# EAGLE schematic NeuroStimDuino_v1_1 (EAGLE 9.6.2)

## Sheet 1 of 6
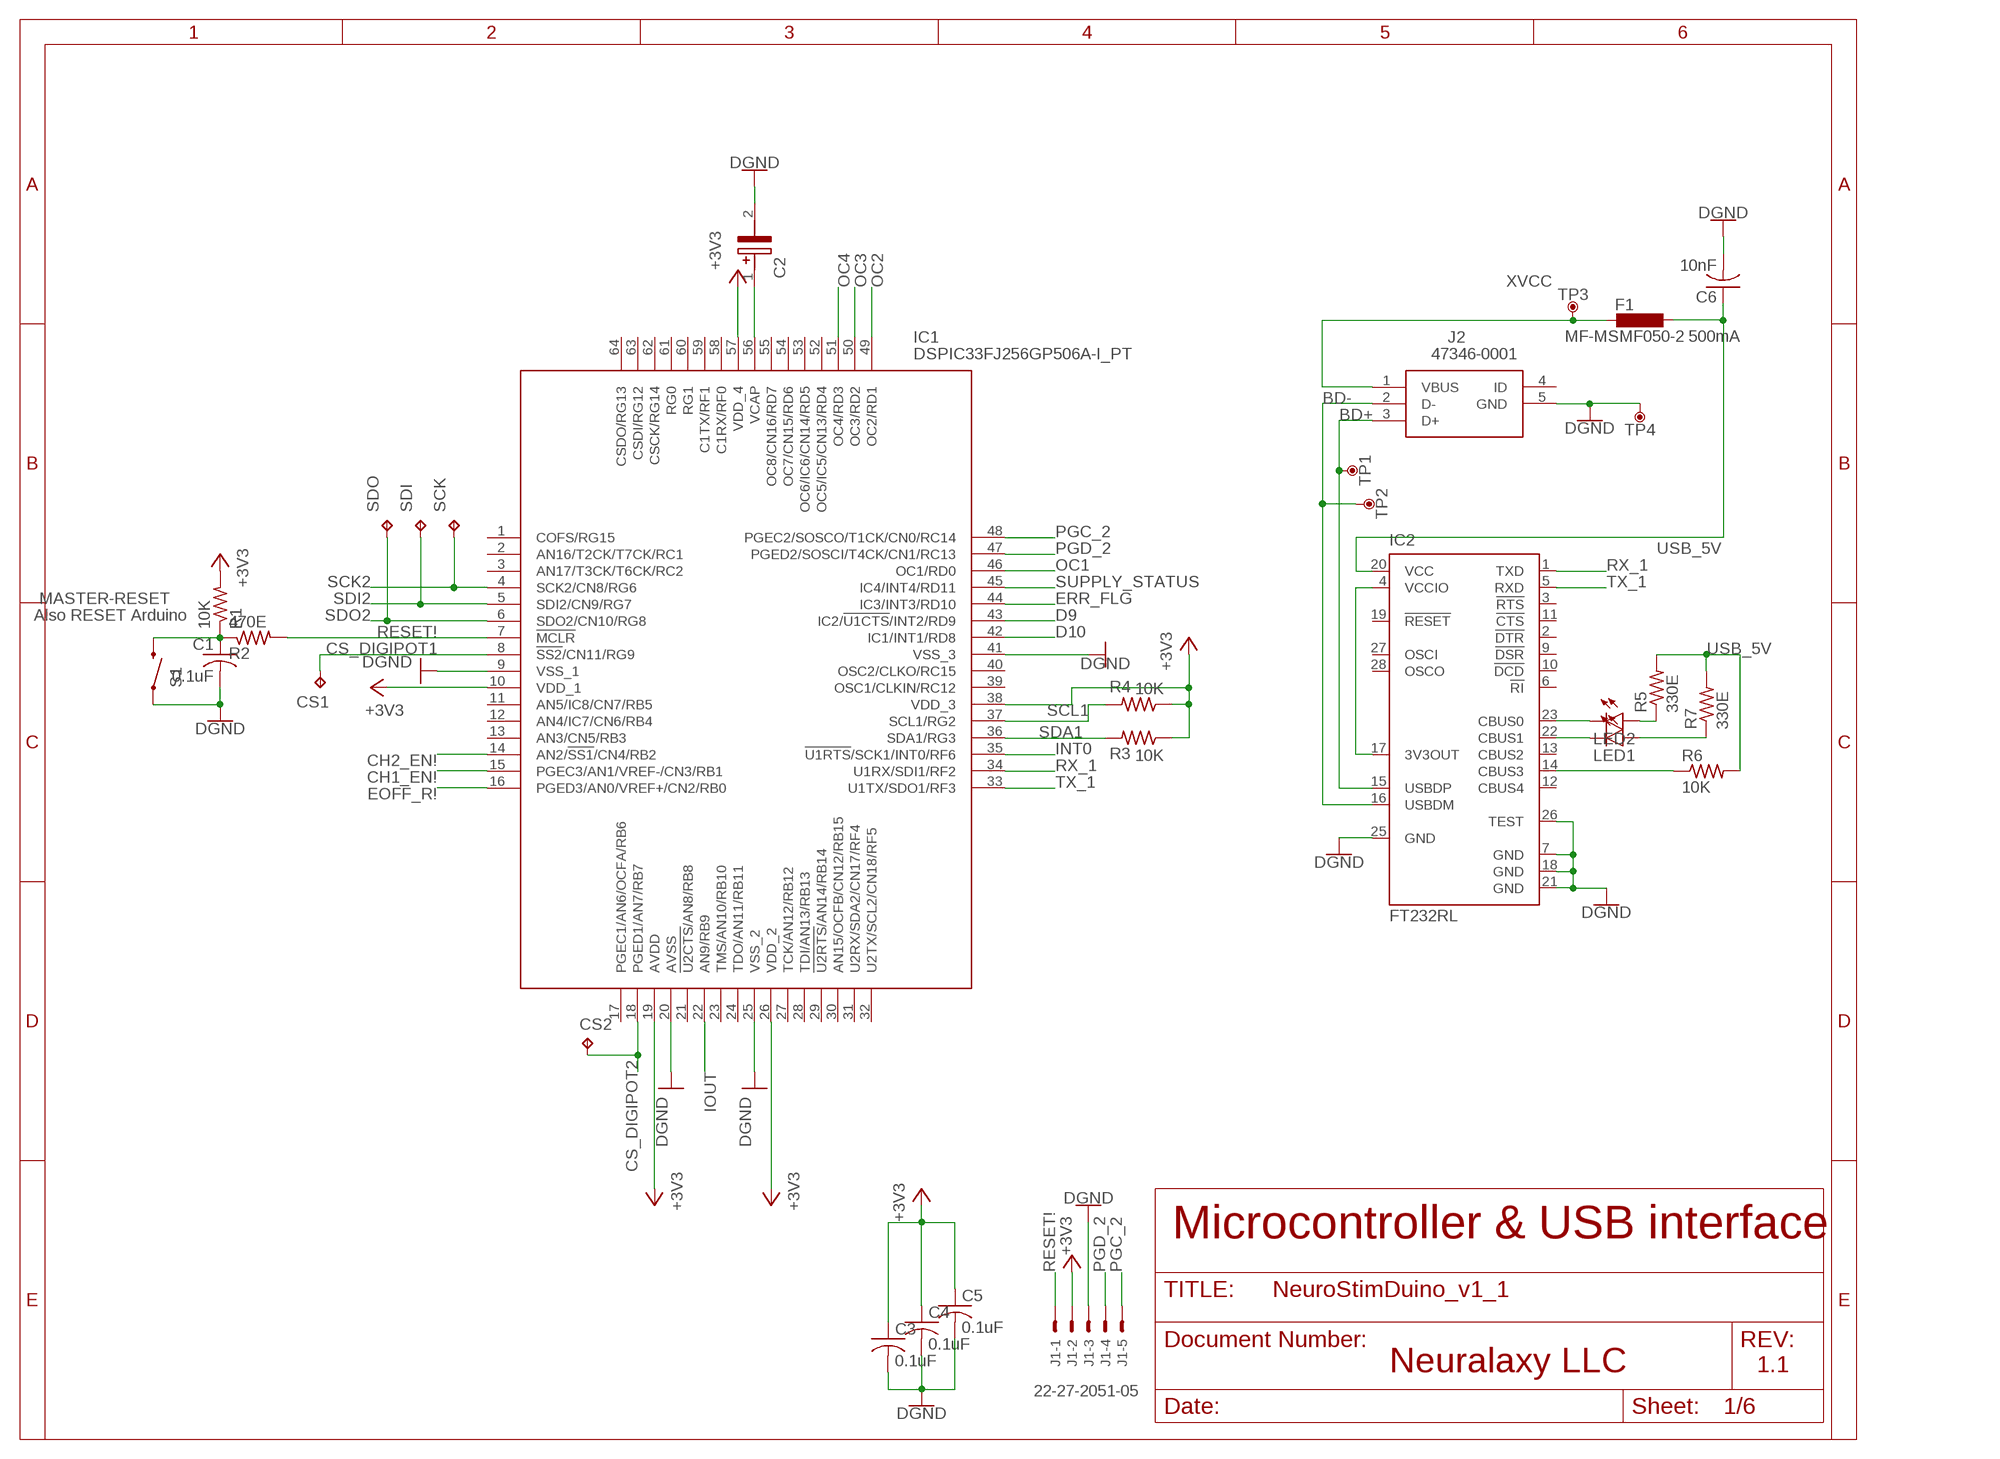
[diagram p0: schematic, sheet 1]

### Parts
C1  0.1uF  C-USC1206  [C1206]
C2  F971C475MAAHT3  [CAPPM3216X180N]
C3  0.1uF  C-USC1206  [C1206]
C4  0.1uF  C-USC1206  [C1206]
C5  0.1uF  C-USC1206  [C1206]
C6  10nF  C-USC1206  [C1206]
CS1  TPTP08R  [TP08R]
CS2  TPTP08R  [TP08R]
F1  MF-MSMF050-2 500mA  0002_MF-MSMF050-2  [L1812]
IC1  DSPIC33FJ256GP506A-I_PT  [QFP50P1200X1200X120-64N]
IC2  FT232RL  [SSOP28]
J1  22-27-2051-05  [6410-05]
J2  47346-0001  [47346-0001]
LED1  LEDCHIPLED_1206  [CHIPLED_1206]
LED2  LEDCHIPLED_1206  [CHIPLED_1206]
R1  10K  R-US_R1206  [R1206]
R2  470E  R-US_R1206  [R1206]
R3  10K  R-US_R1206  [R1206]
R4  10K  R-US_R1206  [R1206]
R5  330E  R-US_R1206  [R1206]
R6  10K  R-US_R1206  [R1206]
R7  330E  R-US_R1206  [R1206]
S1  SWITCH-MOMENTARY-2SMD  [TACTILE_SWITCH_SMD]
SCK  TPTP10R  [TP10R]
SDI  TPTP10R  [TP10R]
SDO  TPTP10R  [TP10R]
TP1  DNP  TPTP-1.00MM  [TP-1.00MM]
TP2  DNP  TPTP-1.00MM  [TP-1.00MM]
TP3  DNP  TPTP-1.00MM  [TP-1.00MM]
TP4  DNP  TPTP-1.00MM  [TP-1.00MM]

### Nets
+3V3: C3.1 C4.1 C5.1 IC1.10(VDD_1) IC1.19(AVDD) IC1.26(VDD_2) IC1.38(VDD_3) IC1.57(VDD_4) J1.2 R1.2 R3.1 R4.1 ; also sheet 2,3,4,5
BD+ [USBpair]: IC2.15(USBDP) J2.3(D+) TP1.X
BD- [USBpair]: IC2.16(USBDM) J2.2(D-) TP2.X
CH1_EN!: IC1.15(PGEC3/AN1/VREF-/CN3/RB1) ; also sheet 3
CH2_EN!: IC1.14(AN2/!SS1!/CN4/RB2) ; also sheet 3
CS_DIGIPOT1: CS1.TP IC1.8(!SS2!/CN11/RG9) ; also sheet 2
CS_DIGIPOT2: CS2.TP IC1.18(PGED1/AN7/RB7) ; also sheet 2
D9: IC1.43(IC2/!U1CTS!/INT2/RD9) ; also sheet 5
D10: IC1.42(IC1/INT1/RD8) ; also sheet 5
EOFF_R!: IC1.16(PGED3/AN0/VREF+/CN2/RB0) ; also sheet 5
ERR_FLG: IC1.44(IC3/INT3/RD10) ; also sheet 4
GND [Power]: C1.2 C2.2(-) C3.2 C4.2 C5.2 C6.2 IC1.9(VSS_1) IC1.20(AVSS) IC1.25(VSS_2) IC1.41(VSS_3) IC2.7(GND) IC2.18(GND) IC2.21(GND) IC2.25(GND) IC2.26(TEST) J1.3 J2.5(GND) S1.1 TP4.X ; supply symbol labelled DGND ; also sheet 2,3,4,5
INT0: IC1.35(!U1RTS!/SCK1/INT0/RF6) ; also sheet 5
IOUT: IC1.22(AN9/RB9) ; also sheet 3,5
MASTER-RESET: C1.1 R1.1 R2.1 S1.3 ; also sheet 5
N$1: C2.1(+) IC1.56(VCAP)
N$146: IC2.4(VCCIO) IC2.17(3V3OUT)
N$147: IC2.23(CBUS0) LED2.C
N$148: LED2.A R5.1
N$149: LED1.A R7.1
N$150: IC2.22(CBUS1) LED1.C
N$151: IC2.14(CBUS3) R6.1
OC1: IC1.46(OC1/RD0) ; also sheet 2
OC2: IC1.49(OC2/RD1) ; also sheet 2
OC3: IC1.50(OC3/RD2) ; also sheet 2
OC4: IC1.51(OC4/RD3) ; also sheet 2
PGC_2: IC1.48(PGEC2/SOSCO/T1CK/CN0/RC14) J1.5
PGD_2: IC1.47(PGED2/SOSCI/T4CK/CN1/RC13) J1.4
RESET!: IC1.7(!MCLR) J1.1 R2.2
RX_1: IC1.34(U1RX/SDI1/RF2) IC2.1(TXD)
SCK2: IC1.4(SCK2/CN8/RG6) SCK.TP ; also sheet 2
SCL1: IC1.37(SCL1/RG2) R4.2 ; also sheet 5
SDA1: IC1.36(SDA1/RG3) R3.2 ; also sheet 5
SDI2: IC1.5(SDI2/CN9/RG7) SDI.TP ; also sheet 2
SDO2: IC1.6(SDO2/CN10/RG8) SDO.TP ; also sheet 2
SUPPLY_STATUS: IC1.45(IC4/INT4/RD11) ; also sheet 4
TX_1: IC1.33(U1TX/SDO1/RF3) IC2.5(RXD)
USB_5V: C6.1 F1.1 IC2.20(VCC) R5.2 R6.2 R7.2 ; also sheet 4
XVCC [usbvcc]: F1.2 J2.1(VBUS) TP3.X
Unconnected: IC1.1(COFS/RG15) IC1.2(AN16/T2CK/T7CK/RC1) IC1.3(AN17/T3CK/T6CK/RC2) IC1.11(AN5/IC8/CN7/RB5) IC1.12(AN4/IC7/CN6/RB4) IC1.13(AN3/CN5/RB3) IC1.17(PGEC1/AN6/OCFA/RB6) IC1.21(!U2CTS!/AN8/RB8) IC1.23(TMS/AN10/RB10) IC1.24(TDO/AN11/RB11) IC1.27(TCK/AN12/RB12) IC1.28(TDI/AN13/RB13) IC1.29(!U2RTS!/AN14/RB14) IC1.30(AN15/OCFB/CN12/RB15) IC1.31(U2RX/SDA2/CN17/RF4) IC1.32(U2TX/SCL2/CN18/RF5) IC1.39(OSC1/CLKIN/RC12) IC1.40(OSC2/CLKO/RC15) IC1.52(OC5/IC5/CN13/RD4) IC1.53(OC6/IC6/CN14/RD5) IC1.54(OC7/CN15/RD6) IC1.55(OC8/CN16/RD7) IC1.58(C1RX/RF0) IC1.59(C1TX/RF1) IC1.60(RG1) IC1.61(RG0) IC1.62(CSCK/RG14) IC1.63(CSDI/RG12) IC1.64(CSDO/RG13) IC2.2(!DTR) IC2.3(!RTS) IC2.6(!RI) IC2.9(!DSR) IC2.10(!DCD) IC2.11(!CTS) IC2.12(CBUS4) IC2.13(CBUS2) IC2.19(!RESET) IC2.27(OSCI) IC2.28(OSCO) J2.4(ID)

### Notes on the sheet
- Also RESET Arduino
- Microcontroller & USB interface
- Neuralaxy LLC | 1.1

## Sheet 2 of 6
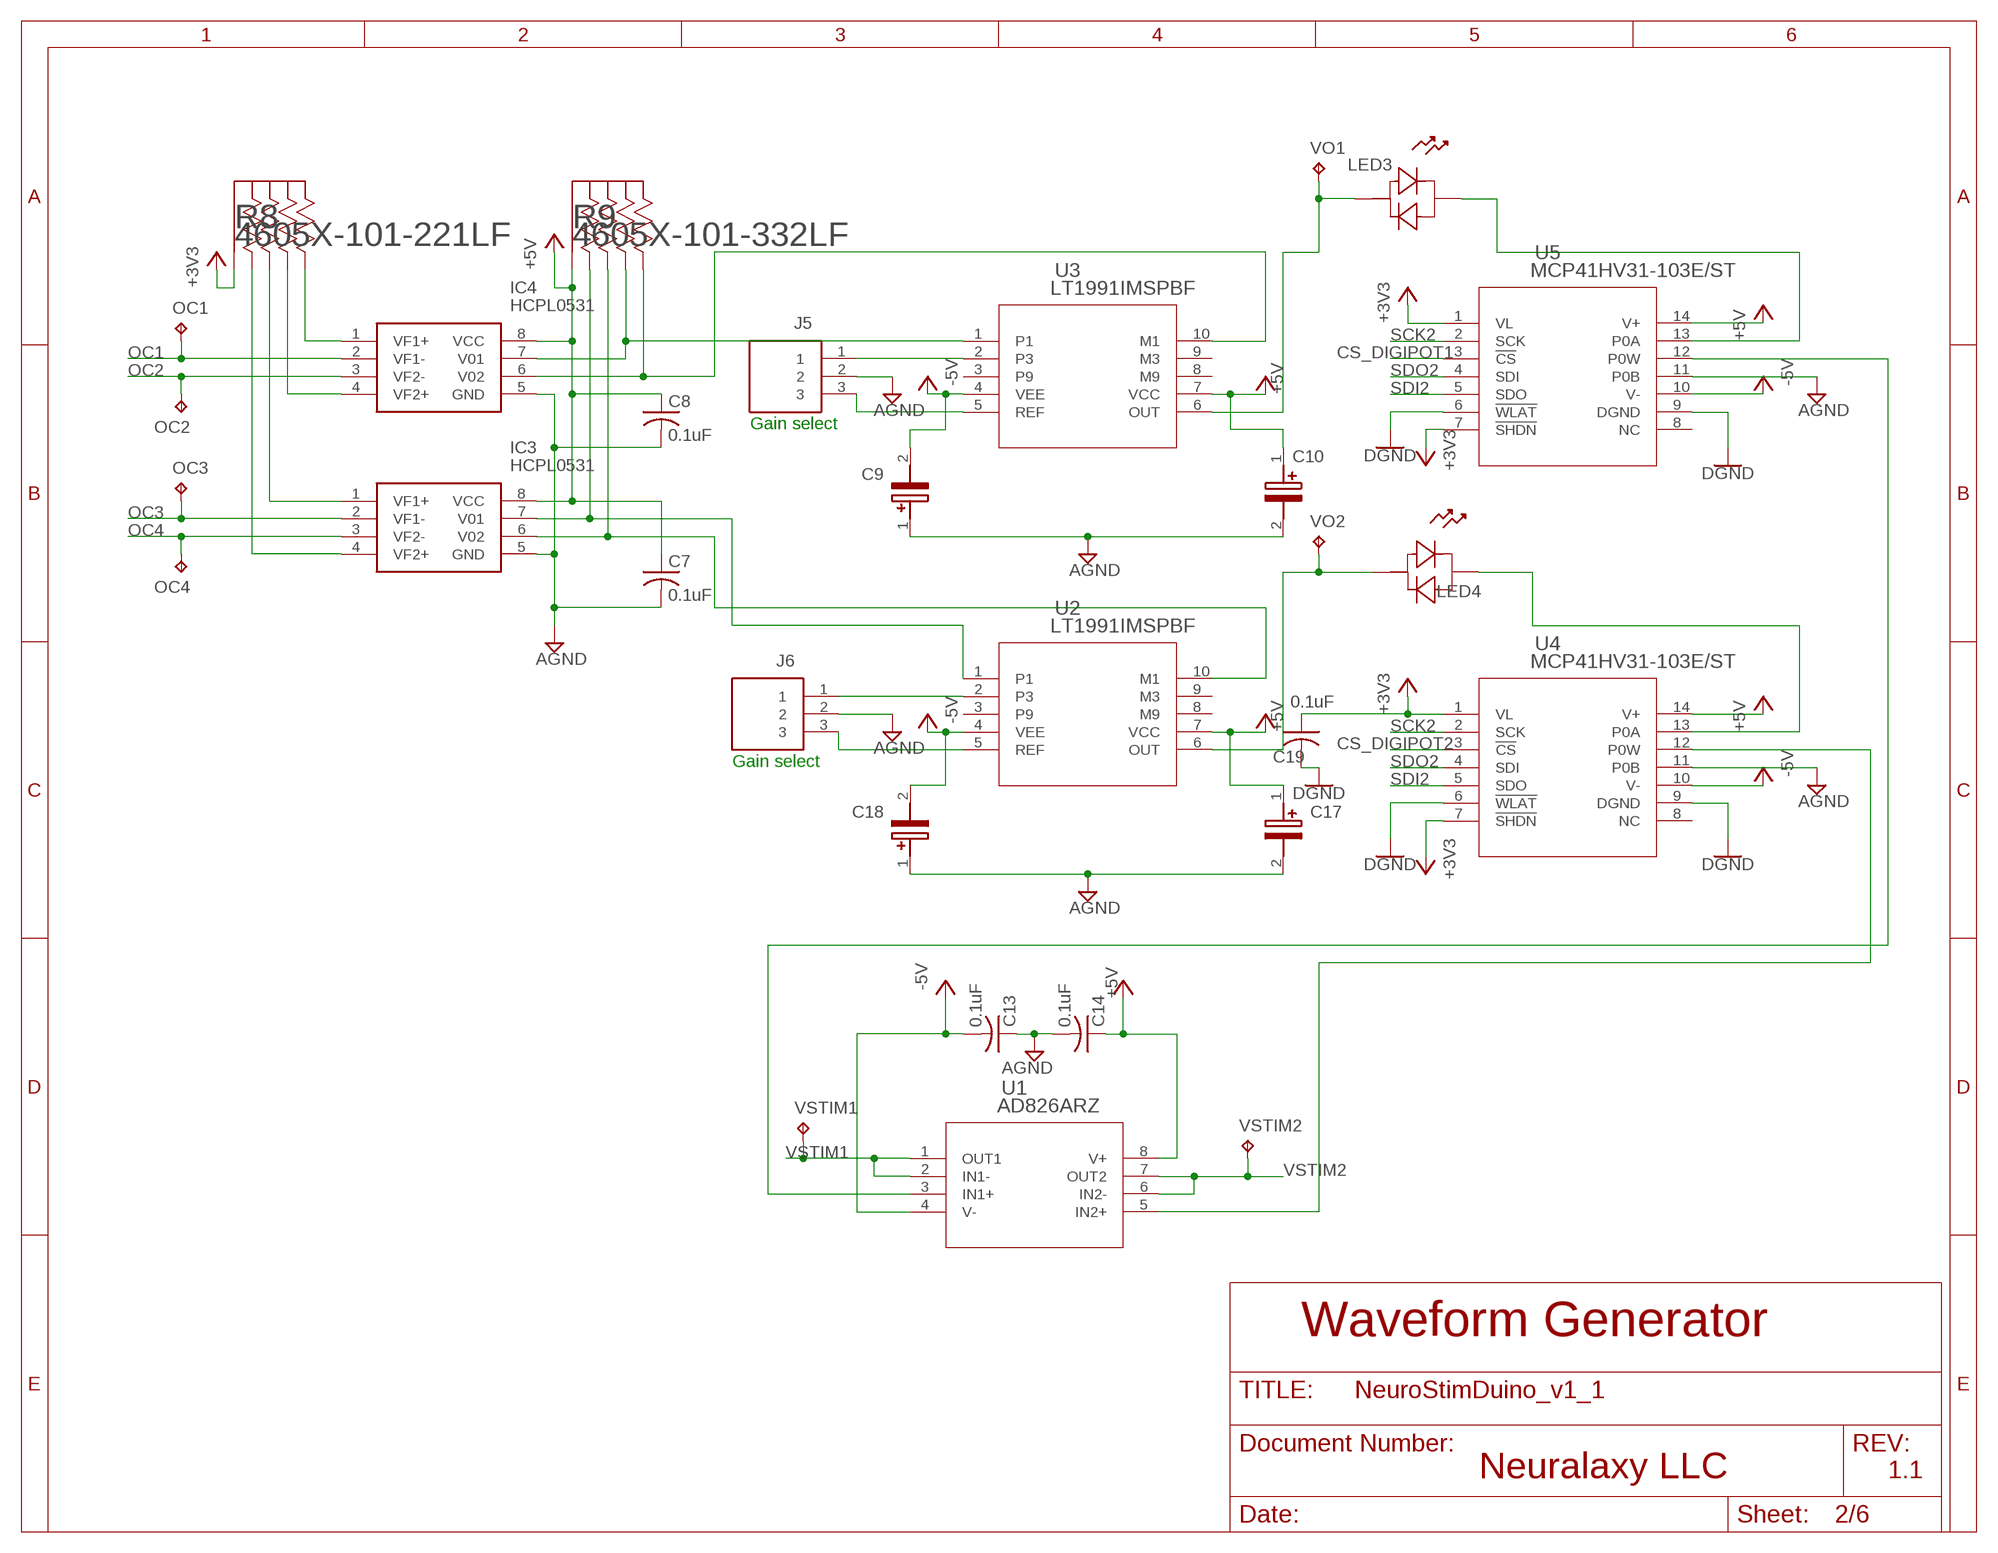
[diagram p1: schematic, sheet 2]

### Parts
C7  0.1uF  C-USC1206  [C1206]
C8  0.1uF  C-USC1206  [C1206]
C9  F971C475MAAHT3  [CAPPM3216X180N]
C10  F971C475MAAHT3  [CAPPM3216X180N]
C13  0.1uF  C-USC1206  [C1206]
C14  0.1uF  C-USC1206  [C1206]
C17  F971C475MAAHT3  [CAPPM3216X180N]
C18  F971C475MAAHT3  [CAPPM3216X180N]
C19  0.1uF  C-USC1206  [C1206]
IC3  HCPL0531  [SOIC127P594X363-8N]
IC4  HCPL0531  [SOIC127P594X363-8N]
J5  TMS-103-02-L-S  [TMS-103-YY-XX-S]
J6  TMS-103-02-L-S  [TMS-103-YY-XX-S]
LED3  XZMDKVG55W-4  [LED_KVG55W-4_SLD]
LED4  XZMDKVG55W-4  [LED_KVG55W-4_SLD]
OC1  TPTP08R  [TP08R]
OC2  TPTP08R  [TP08R]
OC3  TPTP10R  [TP10R]
OC4  TPTP10R  [TP10R]
R8  4605X-101-221LF  [BO_4605X]
R9  4605X-101-332LF  [BO_4605X]
U1  AD826ARZ  [R_8_ADI]
U2  LT1991IMSPBF  [MSOP-10_MS_LIT]
U3  LT1991IMSPBF  [MSOP-10_MS_LIT]
U4  MCP41HV31-103E/ST  [TSSOP14_MC_MCH]
U5  MCP41HV31-103E/ST  [TSSOP14_MC_MCH]
VO1  TPTP10R  [TP10R]
VO2  TPTP10R  [TP10R]
VSTIM1  TPTP08R  [TP08R]
VSTIM2  TPTP08R  [TP08R]

### Nets
+3V3: C19.1 R8.1 U4.1(VL) U4.7(!SHDN) U5.1(VL) U5.7(!SHDN) ; also sheet 1,3,4,5
+5V: C7.1 C8.1 C10.1(+) C14.1 C17.1(+) IC3.8(VCC) IC4.8(VCC) R9.1 U1.8(V+) U2.7(VCC) U3.7(VCC) U4.14(V+) U5.14(V+) ; also sheet 3,4
-5V: C9.2(-) C13.2 C18.2(-) U1.4(V-) U2.4(VEE) U3.4(VEE) U4.10(V-) U5.10(V-) ; also sheet 4
AGND: C7.2 C8.2 C9.1(+) C10.2(-) C13.1 C14.2 C17.2(-) C18.1(+) IC3.5(GND) IC4.5(GND) J5.2 J6.2 U4.11(P0B) U5.11(P0B) ; also sheet 3,4
CS_DIGIPOT1: U5.3(!CS) ; also sheet 1
CS_DIGIPOT2: U4.3(!CS) ; also sheet 1
GND [Power]: C19.2 U4.6(!WLAT) U4.9(DGND) U5.6(!WLAT) U5.9(DGND) ; supply symbol labelled DGND ; also sheet 1,3,4,5
N$2: J5.3 U3.5(REF)
N$3: IC4.7(V01) R9.4 U3.1
N$4: IC4.6(V02) R9.5 U3.10(M1)
N$5: IC3.7(V01) R9.2 U2.1
N$7: IC3.6(V02) R9.3 U2.10(M1)
N$8: IC4.4(VF2+) R8.4
N$9: IC4.1(VF1+) R8.5
N$13: IC3.1(VF1+) R8.3
N$15: IC3.4(VF2+) R8.2
N$16: LED3.1 U3.6(OUT) VO1.TP
N$21: J5.1 U3.2(P3)
N$22: J6.3 U2.5(REF)
N$23: J6.1 U2.2(P3)
N$24: U1.3(IN1+) U5.12(P0W)
N$26: U1.5(IN2+) U4.12(P0W)
N$27: LED4.1 U2.6(OUT) VO2.TP
N$32: LED3.2 U5.13(P0A)
N$38: LED4.2 U4.13(P0A)
OC1: IC4.2(VF1-) OC1.TP ; also sheet 1
OC2: IC4.3(VF2-) OC2.TP ; also sheet 1
OC3: IC3.2(VF1-) OC3.TP ; also sheet 1
OC4: IC3.3(VF2-) OC4.TP ; also sheet 1
SCK2: U4.2(SCK) U5.2(SCK) ; also sheet 1
SDI2: U4.5(SDO) U5.5(SDO) ; also sheet 1
SDO2: U4.4(SDI) U5.4(SDI) ; also sheet 1
VSTIM1: U1.1(OUT1) U1.2(IN1-) VSTIM1.TP ; also sheet 3
VSTIM2: U1.6(IN2-) U1.7(OUT2) VSTIM2.TP ; also sheet 3
Unconnected: U2.3(P9) U2.8(M9) U2.9(M3) U3.3(P9) U3.8(M9) U3.9(M3) U4.8(NC) U5.8(NC)

### Notes on the sheet
- Gain select
- Gain select
- Waveform Generator
- Neuralaxy LLC | 1.1

## Sheet 3 of 6
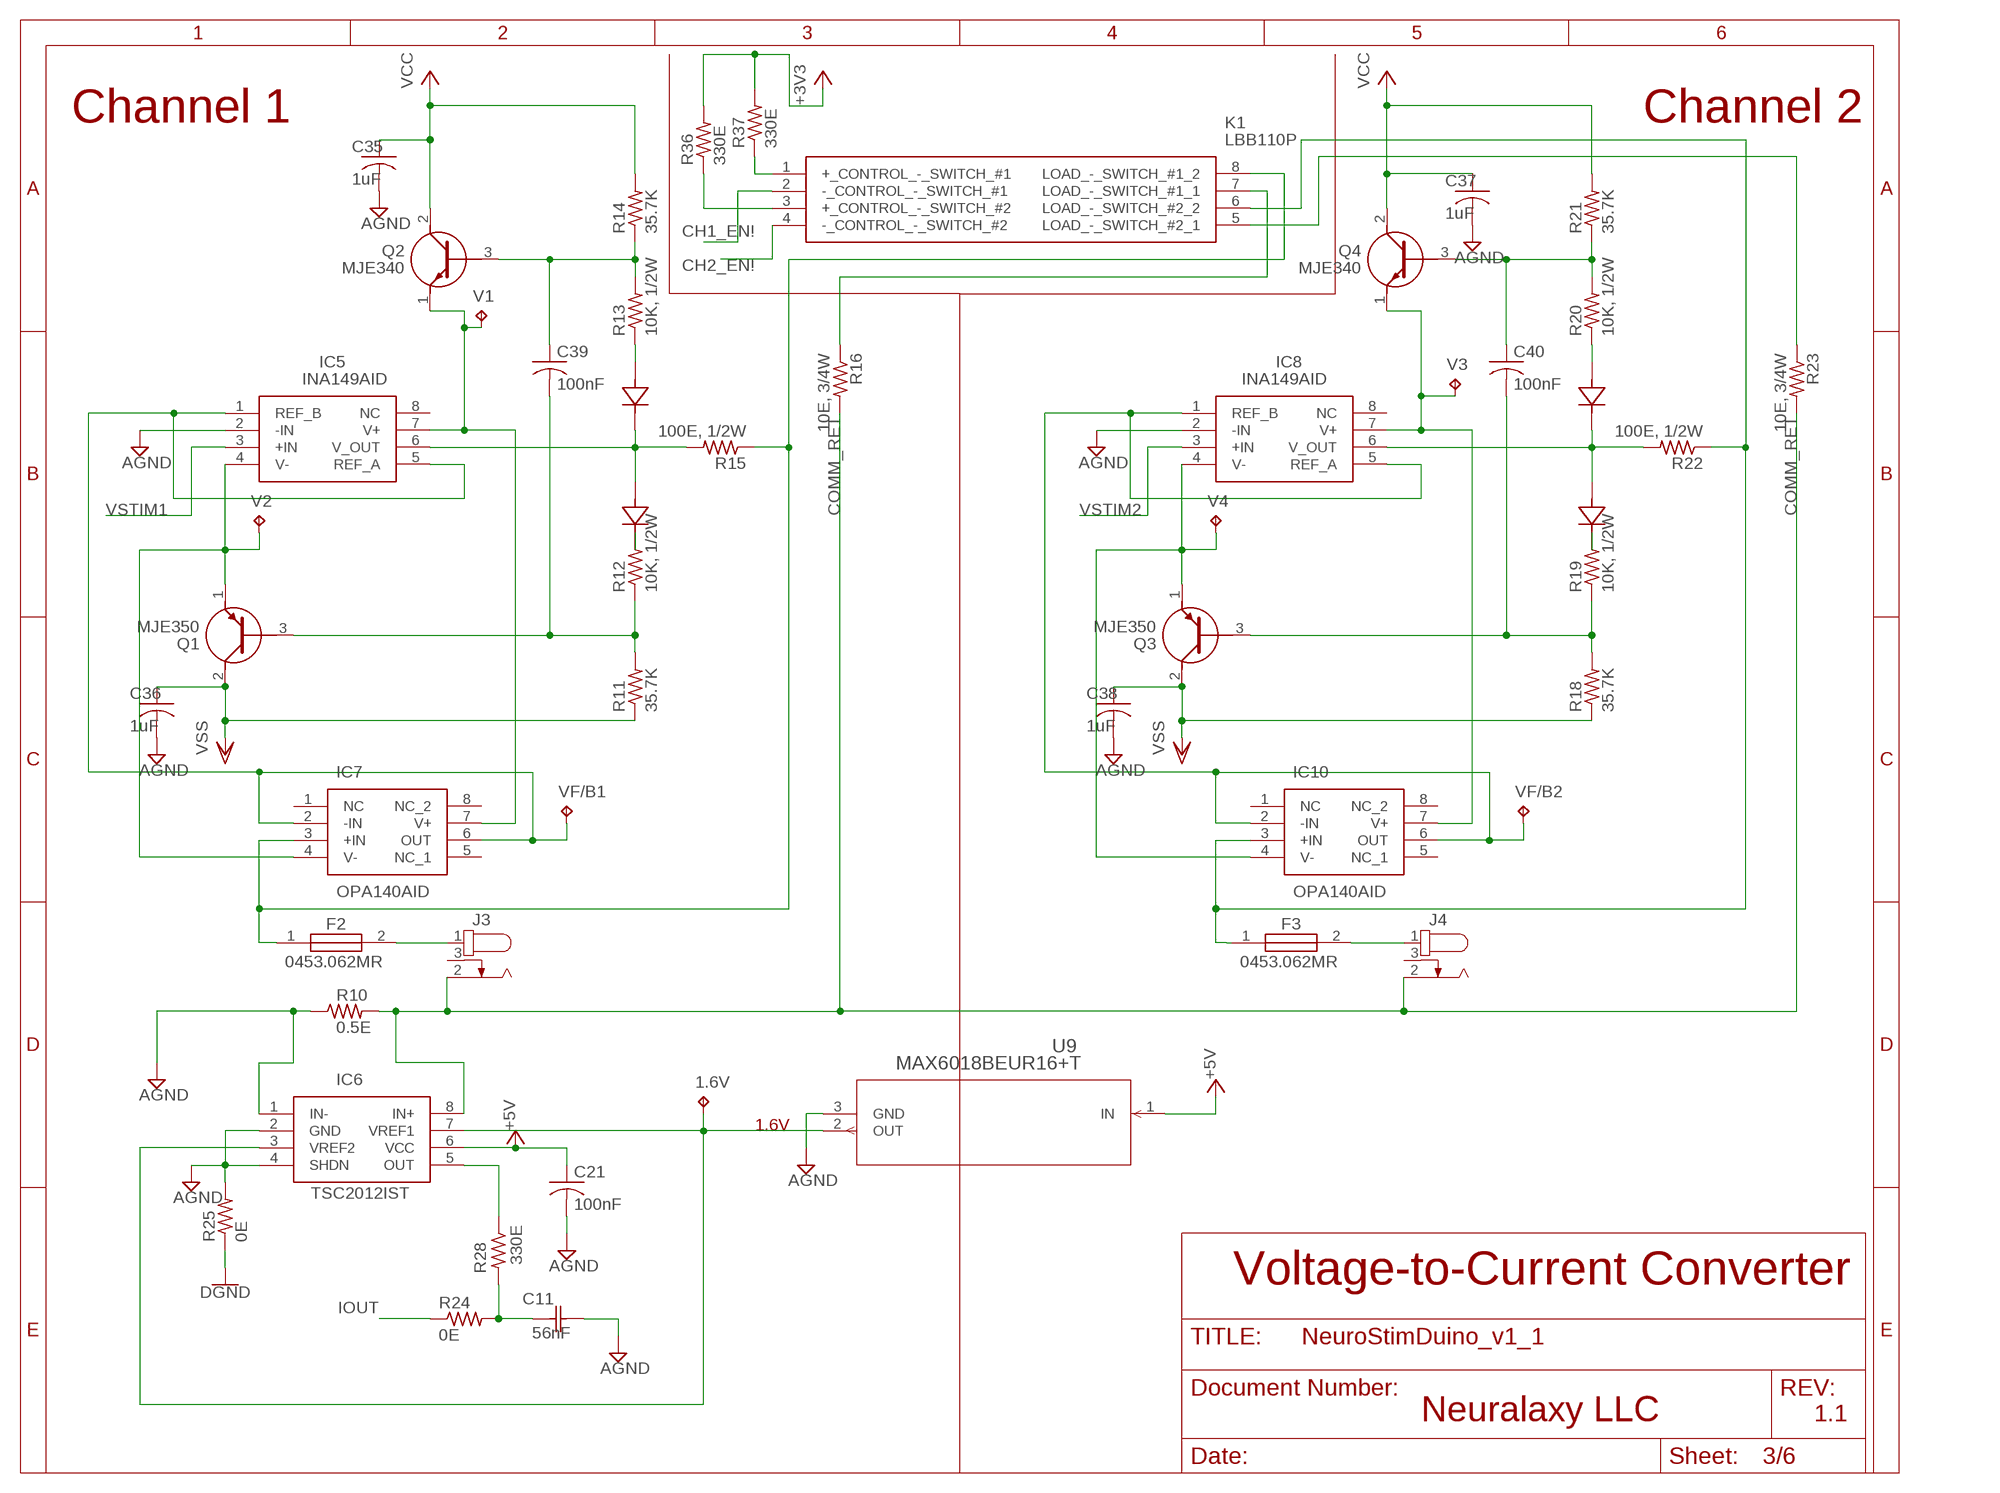
[diagram p2: schematic, sheet 3]

### Parts
1.6V  TPTP10R  [TP10R]
C11  56nF  C0603C563J4RACTU  [CAPC17595_87N_KEM]
C21  100nF  C-USC1206  [C1206]
C35  1uF  C-USC0805  [C0805]
C36  1uF  C-USC0805  [C0805]
C37  1uF  C-USC0805  [C0805]
C38  1uF  C-USC0805  [C0805]
C39  100nF  C-USC0805K  [C0805K]
C40  100nF  C-USC0805K  [C0805K]
D6  GF1J-E3DO-214BA-L  [DO-214BA-L]
D7  GF1J-E3DO-214BA-L  [DO-214BA-L]
D8  GF1J-E3DO-214BA-L  [DO-214BA-L]
D9  GF1J-E3DO-214BA-L  [DO-214BA-L]
F2  0453.062MR  [FUSC6127X294N]
F3  0453.062MR  [FUSC6127X294N]
IC5  INA149AID  [SOIC127P600X175-8N]
IC6  TSC2012IST  [SOP65P490X110-8N]
IC7  OPA140AID  [SOIC127P600X175-8N]
IC8  INA149AID  [SOIC127P600X175-8N]
IC10  OPA140AID  [SOIC127P600X175-8N]
J3  694101308002  [694101308002]
J4  694101308002  [694101308002]
K1  LBB110P  [SOP254P940X229-8N]
Q1  MJE350  [TO229P300X760X1364-3P]
Q2  MJE340  [TO229P290X760X1320-3P]
Q3  MJE350  [TO229P300X760X1364-3P]
Q4  MJE340  [TO229P290X760X1320-3P]
R10  0.5E  R-US_R1206  [R1206]
R11  35.7K  R-US_R1206  [R1206]
R12  10K, 1/2W  R-US_R1206  [R1206]
R13  10K, 1/2W  R-US_R1206  [R1206]
R14  35.7K  R-US_R1206  [R1206]
R15  100E, 1/2W  R-US_R1206  [R1206]
R16  10E, 3/4W  R-US_R1206  [R1206]
R18  35.7K  R-US_R1206  [R1206]
R19  10K, 1/2W  R-US_R1206  [R1206]
R20  10K, 1/2W  R-US_R1206  [R1206]
R21  35.7K  R-US_R1206  [R1206]
R22  100E, 1/2W  R-US_R1206  [R1206]
R23  10E, 3/4W  R-US_R1206  [R1206]
R24  0E  R-US_R1206  [R1206]
R25  0E  R-US_R1206  [R1206]
R28  330E  R-US_R0603  [R0603]
R36  330E  R-US_R1206  [R1206]
R37  330E  R-US_R1206  [R1206]
U9  MAX6018BEUR16+T  [21-0051H_MXM]
V1  TPTP10R  [TP10R]
V2  TPTP10R  [TP10R]
V3  TPTP10R  [TP10R]
V4  TPTP10R  [TP10R]
VF/B1  TPTP10R  [TP10R]
VF/B2  TPTP10R  [TP10R]

### Nets
+3V3: R36.2 R37.2 ; also sheet 1,2,4,5
+5V: C21.1 IC6.6(VCC) U9.1(IN) ; also sheet 2,4
AGND: C11.2 C21.2 C35.2 C36.2 C37.2 C38.2 IC5.2(-IN) IC6.1(IN-) IC6.2(GND) IC6.4(SHDN) IC8.2(-IN) R10.1 R25.2 U9.3(GND) ; also sheet 2,4
CH1_EN!: K1.2(-_CONTROL_-_SWITCH_#1) ; also sheet 1
CH2_EN!: K1.4(-_CONTROL_-_SWITCH_#2) ; also sheet 1
COMM_RET: IC6.8(IN+) J3.2 J4.2 R10.2 R16.2 R23.2
GND [Power]: R25.1 ; supply symbol labelled DGND ; also sheet 1,2,4,5
IOUT: R24.1 ; also sheet 1,5
N$14: K1.1(+_CONTROL_-_SWITCH_#1) R37.1
N$17: K1.3(+_CONTROL_-_SWITCH_#2) R36.1
N$19: IC6.5(OUT) R28.1
N$25: 1.6V.TP IC6.3(VREF2) IC6.7(VREF1) U9.2(OUT)
N$28: C11.1 R24.2 R28.2
N$45: IC5.4(V-) IC7.4(V-) Q1.1(E) V2.TP
N$46: IC5.1(REF_B) IC5.5(REF_A) IC7.2(-IN) IC7.6(OUT) VF/B1.TP
N$47: C39.1 Q2.3(B) R13.2 R14.1
N$48: C39.2 Q1.3(B) R11.2 R12.1
N$49: D6.2 R13.1
N$50: D7.1 R12.2
N$51: D6.1 D7.2 IC5.6(V_OUT) R15.2
N$52: IC5.7(V+) IC7.7(V+) Q2.1(E) V1.TP
N$53: K1.7(LOAD_-_SWITCH_#1_1) R16.1
N$54: F2.1 IC7.3(+IN) K1.8(LOAD_-_SWITCH_#1_2) R15.1
N$55: K1.5(LOAD_-_SWITCH_#2_1) R23.1
N$56: F2.2 J3.1
N$57: C40.1 Q4.3(B) R20.2 R21.1
N$58: C40.2 Q3.3(B) R18.2 R19.1
N$59: D8.2 R20.1
N$60: D9.1 R19.2
N$61: D8.1 D9.2 IC8.6(V_OUT) R22.2
N$62: IC8.1(REF_B) IC8.5(REF_A) IC10.2(-IN) IC10.6(OUT) VF/B2.TP
N$63: IC8.7(V+) IC10.7(V+) Q4.1(E) V3.TP
N$64: IC8.4(V-) IC10.4(V-) Q3.1(E) V4.TP
N$65: F3.1 IC10.3(+IN) K1.6(LOAD_-_SWITCH_#2_2) R22.1
N$66: F3.2 J4.1
VCC: C35.1 C37.1 Q2.2(C) Q4.2(C) R14.2 R21.2 ; also sheet 4
VSS: C36.1 C38.1 Q1.2(C) Q3.2(C) R11.1 R18.1 ; also sheet 4
VSTIM1: IC5.3(+IN) ; also sheet 2
VSTIM2: IC8.3(+IN) ; also sheet 2
Unconnected: IC5.8(NC) IC7.1(NC) IC7.5(NC_1) IC7.8(NC_2) IC8.8(NC) IC10.1(NC) IC10.5(NC_1) IC10.8(NC_2) J3.3 J4.3

### Notes on the sheet
- Channel 1 | Channel 2
- 1.6V
- TSC2012IST
- Voltage-to-Current Converter
- Neuralaxy LLC | 1.1

## Sheet 4 of 6
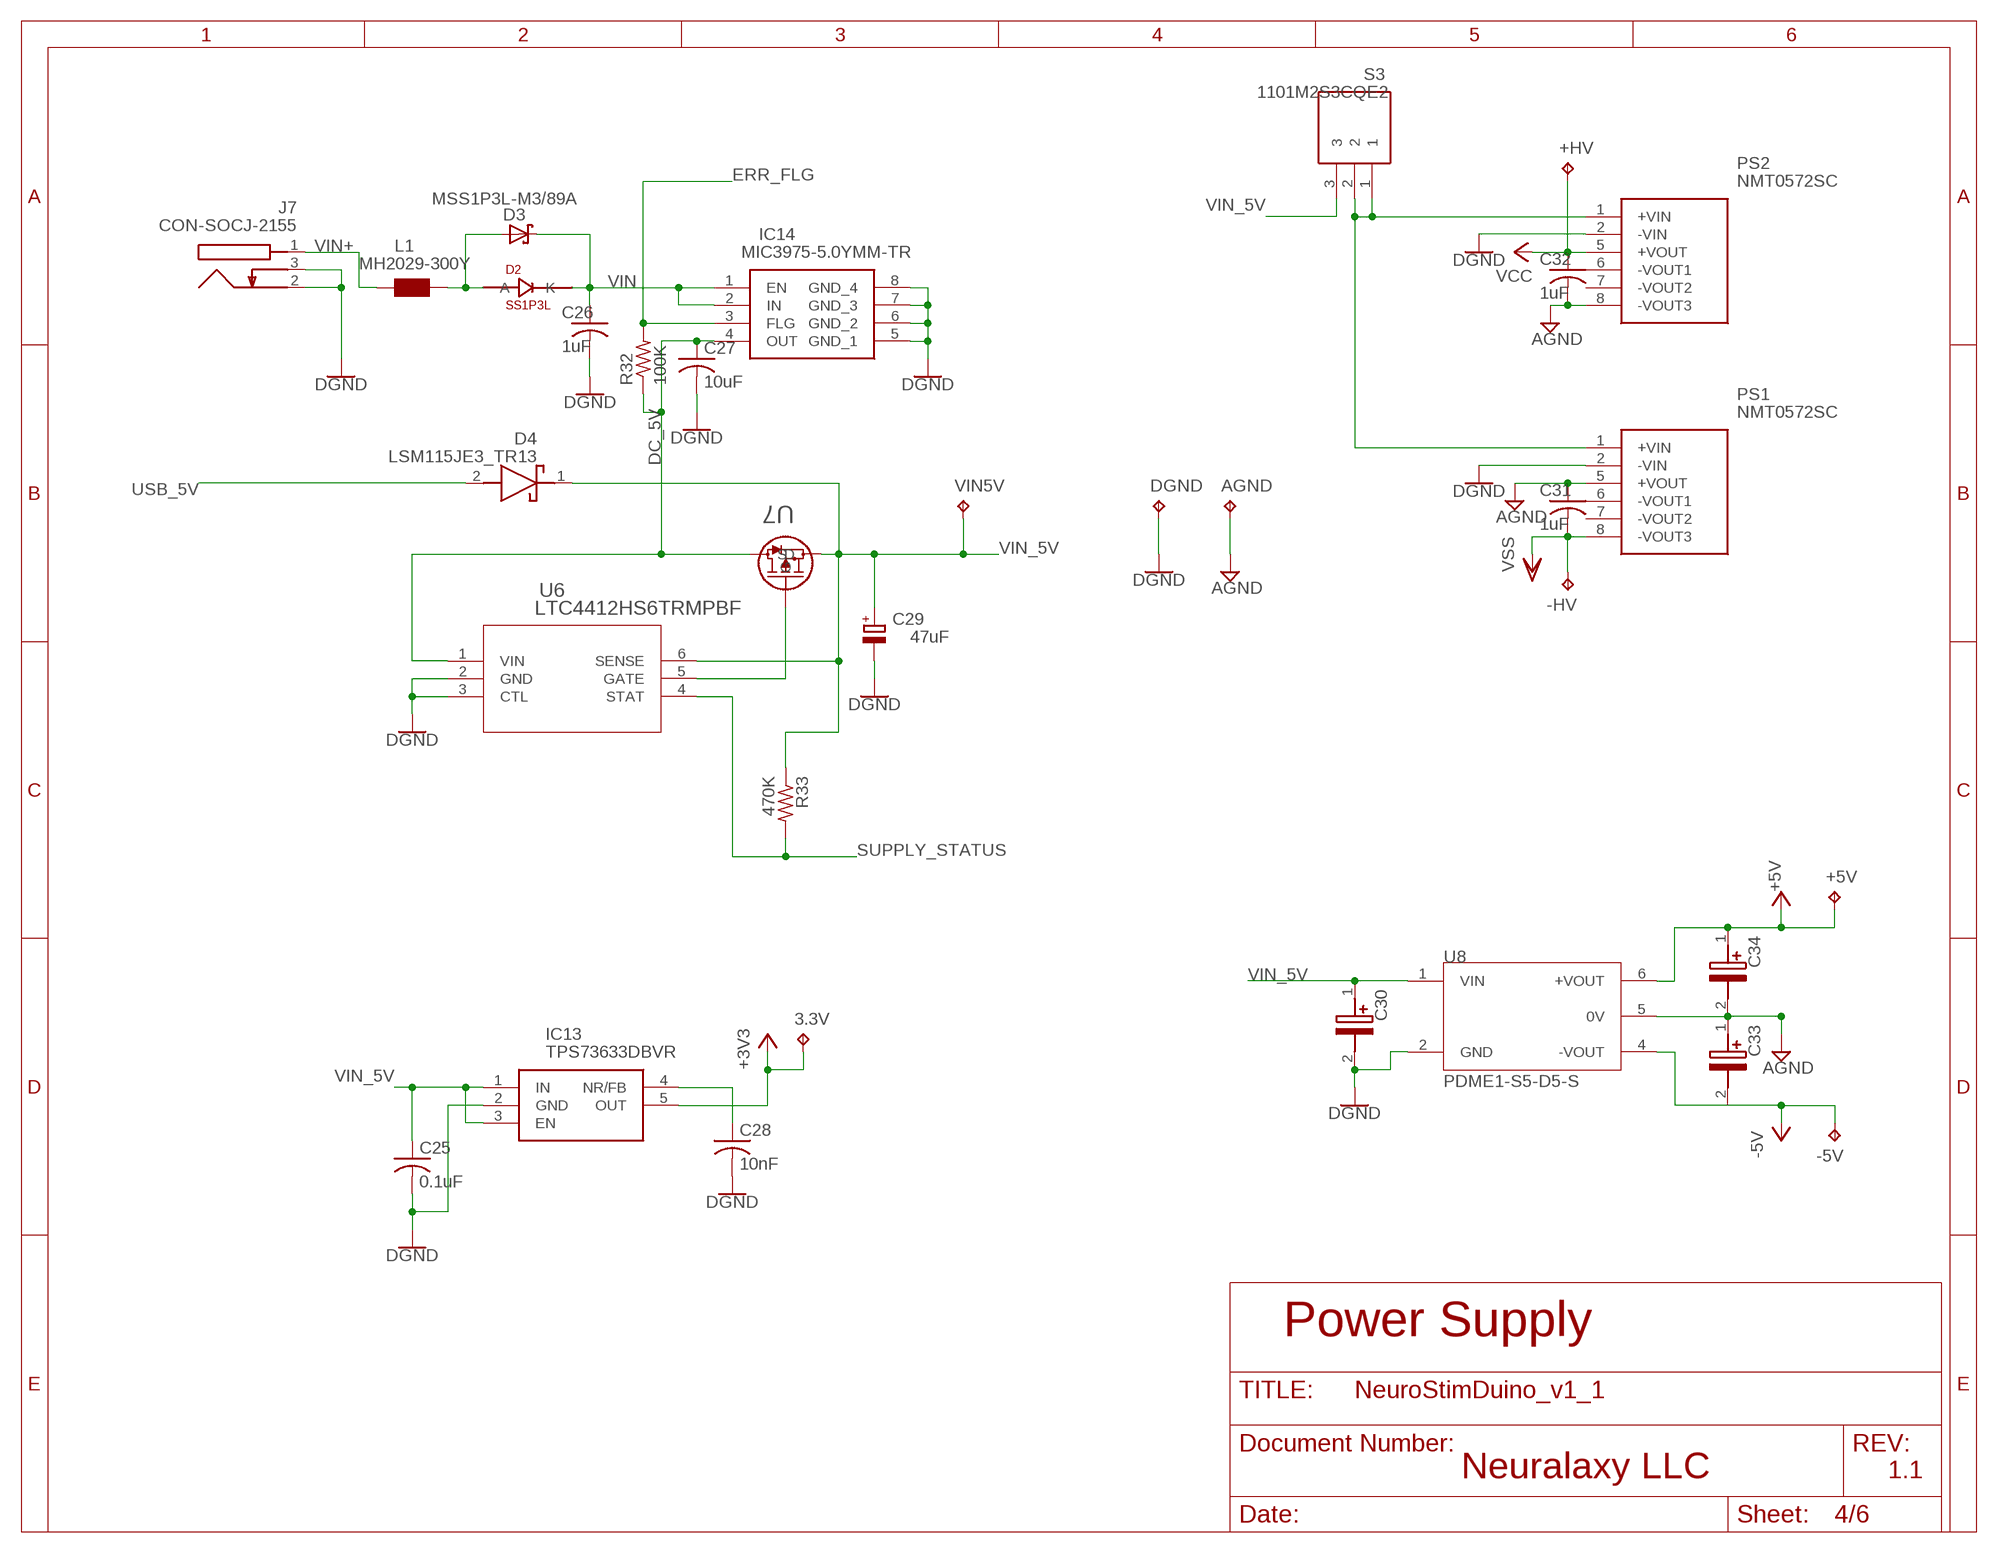
[diagram p3: schematic, sheet 4]

### Parts
3.3V  TPTP10R  [TP10R]
+5V  TPTP10R  [TP10R]
+HV  TPTP10R  [TP10R]
-5V  TPTP10R  [TP10R]
-HV  TPTP10R  [TP10R]
AGND  TPTP10R  [TP10R]
C25  0.1uF  C-USC1206  [C1206]
C26  1uF  C-USC0805  [C0805]
C27  10uF  C-USC0805  [C0805]
C28  10nF  C-USC1206  [C1206]
C29  47uF  0113_47UF  [PANASONIC_D]
C30  4.7uF  593D475X9050D2TE3  [CAPPM7343X310N]
C31  1uF  C-USC0805  [C0805]
C32  1uF  C-USC0805  [C0805]
C33  4.7uF  593D475X9050D2TE3  [CAPPM7343X310N]
C34  4.7uF  593D475X9050D2TE3  [CAPPM7343X310N]
D2  SS1P3L  0025_SS1P3L-M3/84A  [DO220AAL]
D3  MSS1P3L-M3/89A  1653_MSS1P3L-M3/89A  [MICROSMP]
D4  LSM115JE3_TR13  [DIOM5436X330N]
DGND  TPTP10R  [TP10R]
IC13  TPS73633DBVR  [SOT95P280X145-5N]
IC14  MIC3975-5.0YMM-TR  [SOP65P490X109-8N]
J7  CON-SOCJ-2155  [CONSOCJ2155]
L1  MH2029-300Y  0001_BLM21PG300SN1D_/_MH2029-300Y  [0805]
PS1  NMT0572SC  [NMT1272SC]
PS2  NMT0572SC  [NMT1272SC]
R32  100K  R-US_R1206  [R1206]
R33  470K  R-US_R1206  [R1206]
S3  1101M2S3CQE2  [1000-SERIES(SPDT)]
U6  LTC4412HS6TRMPBF  [TSOT-23_S6_ADI]
U7  PMV48XP,215TO-236_SOT23_NEX-L  [TO-236_SOT23_NEX-L]
U8  PDME1-S5-D5-S  [CONV_PDME1-S5-D5-S]
VIN5V  TPTP10R  [TP10R]

### Nets
+3V3: 3.3V.TP IC13.5(OUT) ; also sheet 1,2,3,5
+5V: +5V.TP C34.1(+) U8.6(+VOUT) ; also sheet 2,3
-5V: -5V.TP C33.2(-) U8.4(-VOUT) ; also sheet 2
AGND: AGND.TP C31.1 C32.2 C33.1(+) C34.2(-) PS1.5(+VOUT) PS2.8(-VOUT3) U8.5(0V) ; also sheet 2,3
DC_5V: C27.1 IC14.4(OUT) R32.1 U6.1(VIN) U7.3(D)
ERR_FLG: IC14.3(FLG) R32.2 ; also sheet 1
GND [Power]: C25.2 C26.2 C27.2 C28.2 C29.- C30.2(-) DGND.TP IC13.2(GND) IC14.5(GND_1) IC14.6(GND_2) IC14.7(GND_3) IC14.8(GND_4) J7.2 J7.3 PS1.2(-VIN) PS2.2(-VIN) U6.2(GND) U6.3(CTL) U8.2(GND) ; supply symbol labelled DGND ; also sheet 1,2,3,5
N$6: C28.1 IC13.4(NR/FB)
N$10: PS1.1(+VIN) PS2.1(+VIN) S3.1 S3.2
N$20: U6.5(GATE) U7.1(G)
N$107: D2.P$2(A) D3.A L1.1
SUPPLY_STATUS: R33.2 U6.4(STAT) ; also sheet 1
USB_5V: D4.2(A) ; also sheet 1
VCC: +HV.TP C32.1 PS2.5(+VOUT) ; also sheet 3
VIN: C26.1 D2.P$1(K) D3.K(C) IC14.1(EN) IC14.2(IN) ; also sheet 5
VIN+: J7.1 L1.2
VIN_5V: C25.1 C29.+ C30.1(+) D4.1(K) IC13.1(IN) IC13.3(EN) R33.1 S3.3 U6.6(SENSE) U7.2(S) U8.1(VIN) VIN5V.TP ; also sheet 5
VSS: -HV.TP C31.2 PS1.8(-VOUT3) ; also sheet 3
Unconnected: PS1.6(-VOUT1) PS1.7(-VOUT2) PS2.6(-VOUT1) PS2.7(-VOUT2)

### Notes on the sheet
- Power Supply
- Neuralaxy LLC | 1.1

## Sheet 5 of 6
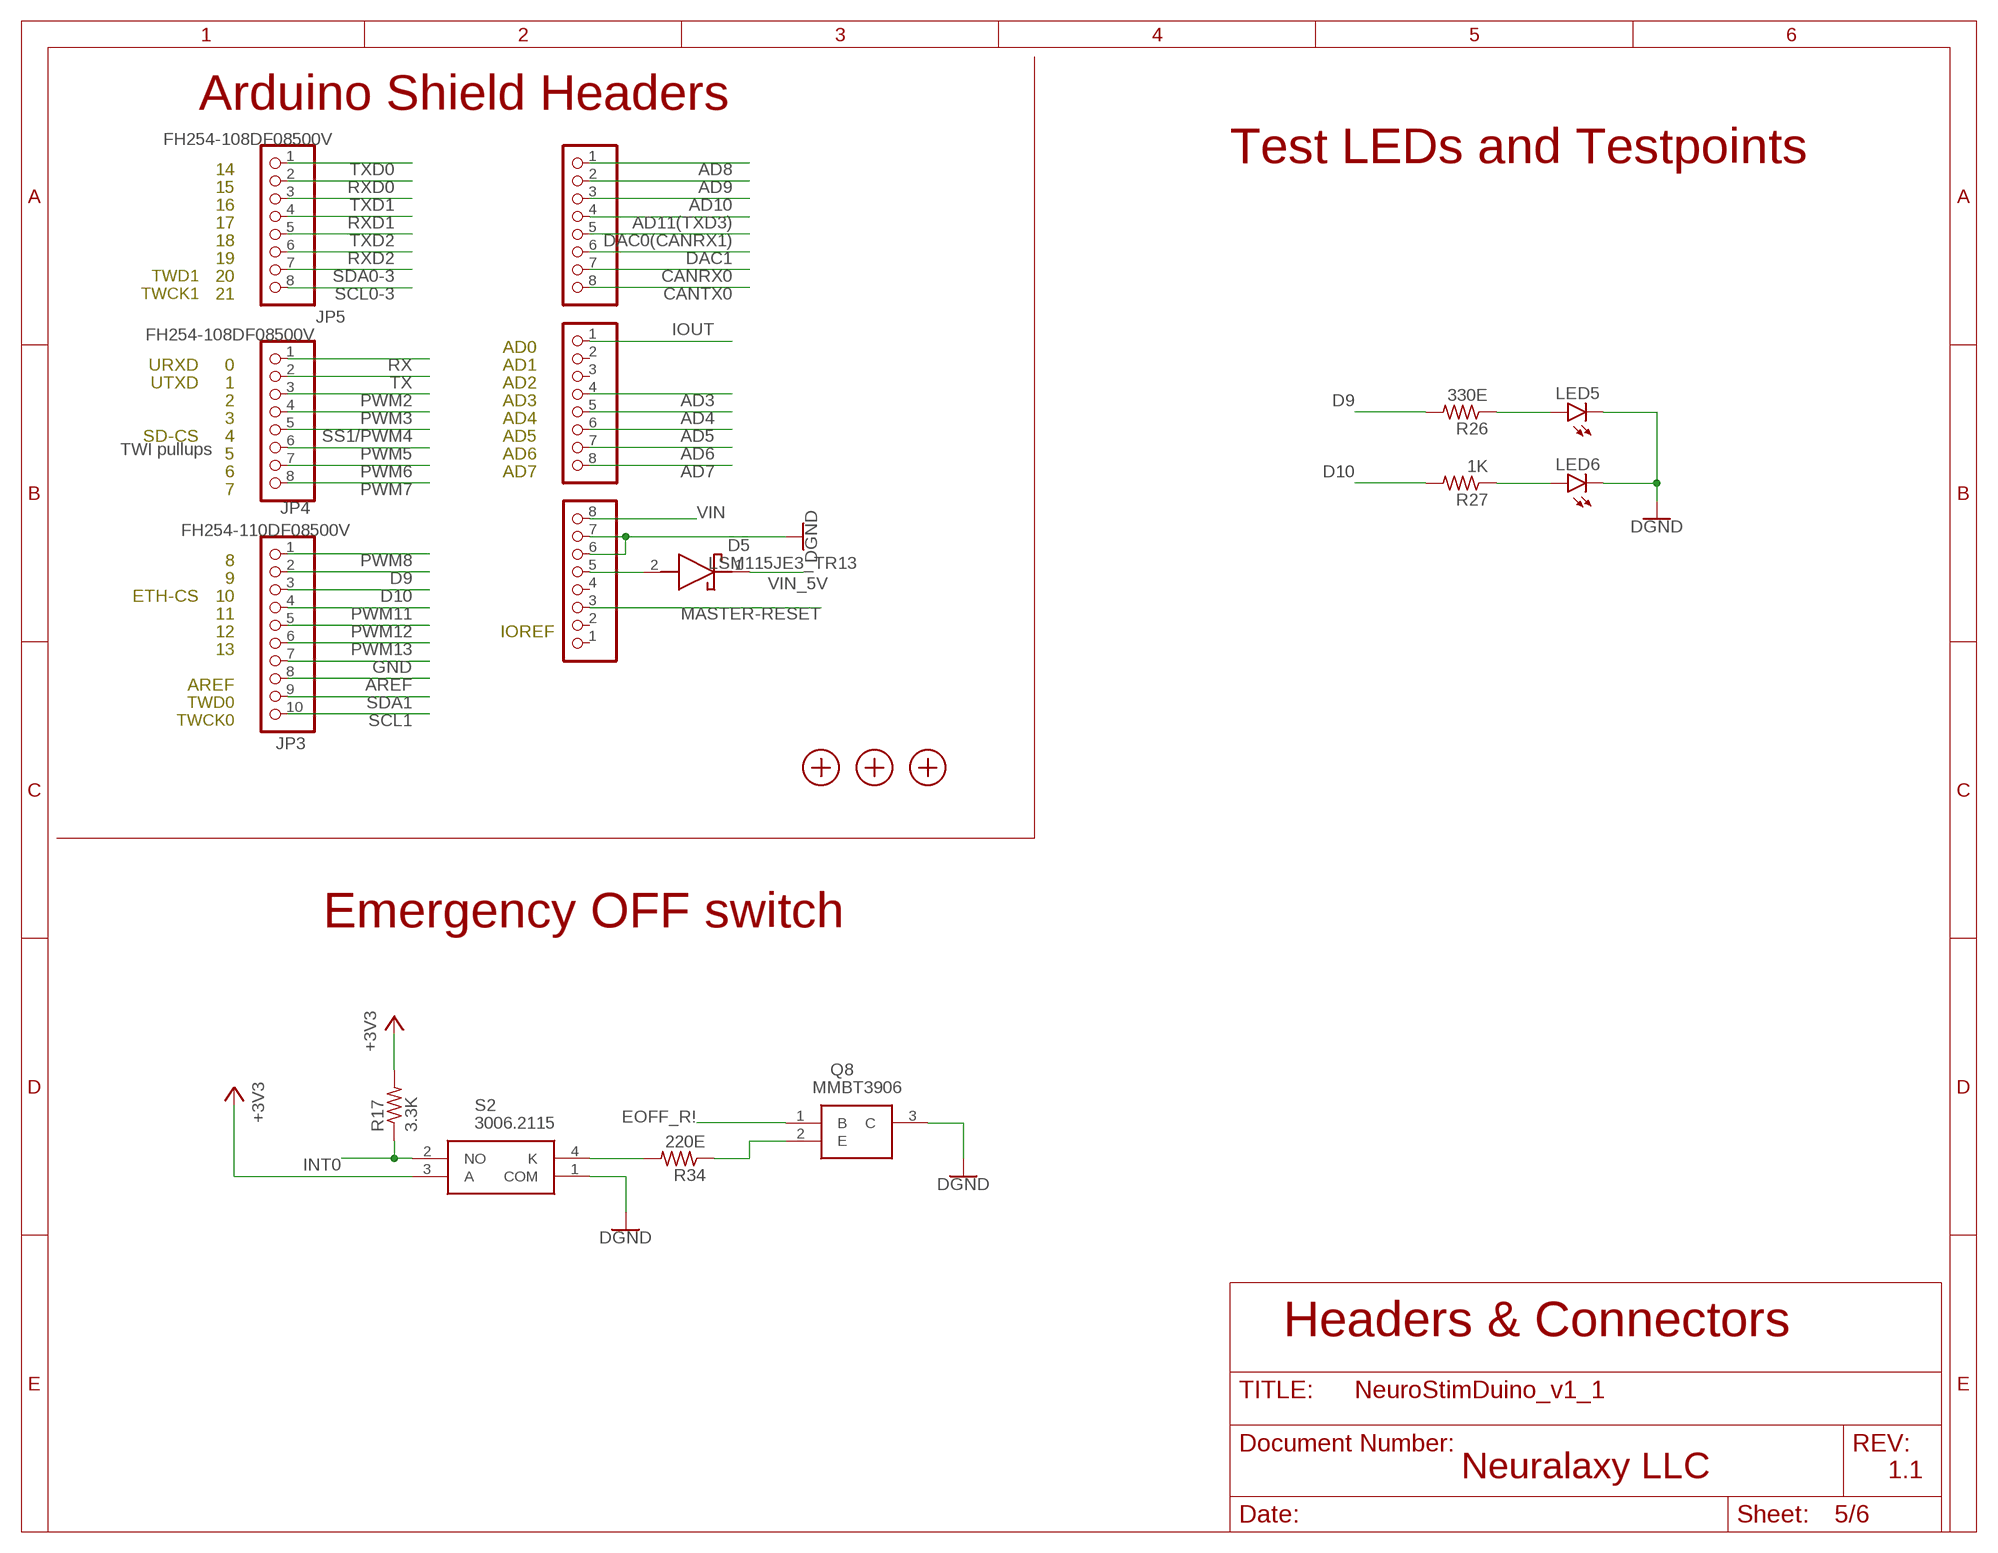
[diagram p4: schematic, sheet 5]

### Parts
D5  LSM115JE3_TR13  [DIOM5436X330N]
JP3  FH254-110DF08500V  1684_20TW-537  [1X10]
JP4  FH254-108DF08500V  1683_20TW-536  [1X08]
JP5  FH254-108DF08500V  1683_20TW-536  [1X08]
JP6  FH254-108DF08500V  1683_20TW-536  [1X08]
JP7  FH254-108DF08500V  1683_20TW-536  [1X08]
JP8  FH254-108DF08500V  1683_20TW-536  [1X08]
LED5  LEDCHIPLED_1206  [CHIPLED_1206]
LED6  LEDCHIPLED_1206  [CHIPLED_1206]
Q8  MMBT3906  [SOT95P240X120-3N]
R17  3.3K  R-US_R1206  [R1206]
R26  330E  R-US_R0603  [R0603]
R27  1K  R-US_R0603  [R0603]
R34  220E  R-US_R1206  [R1206]
S2  3006.2115  [30062115]
U$1  FIDUCIALMOUNT  [FIDUCIA-MOUNT]
U$2  FIDUCIALMOUNT  [FIDUCIA-MOUNT]
U$3  FIDUCIALMOUNT  [FIDUCIA-MOUNT]

### Nets
+3V3: R17.2 S2.3(A) ; also sheet 1,2,3,4
AD3: JP7.4
AD4: JP7.5
AD5: JP7.6
AD6: JP7.7
AD7: JP7.8
AD8: JP8.1
AD9: JP8.2
AD10: JP8.3
AD11(TXD3): JP8.4
AREF: JP3.8
CANRX0: JP8.7
CANTX0: JP8.8
D9: JP3.2 R26.2 ; also sheet 1
D10: JP3.3 R27.2 ; also sheet 1
DAC0(CANRX1): JP8.5
DAC1: JP8.6
EOFF_R!: Q8.1(B) ; also sheet 1
GND [Power]: JP3.7 JP6.6 JP6.7 LED5.C LED6.C Q8.3(C) S2.1(COM) ; supply symbol labelled DGND ; also sheet 1,2,3,4
INT0: R17.1 S2.2(NO) ; also sheet 1
IOUT: JP7.1 ; also sheet 1,3
MASTER-RESET: JP6.3 ; also sheet 1
N$11: D5.2(A) JP6.5
N$12: R34.2 S2.4(K)
N$18: Q8.2(E) R34.1
N$30: LED6.A R27.1
N$31: LED5.A R26.1
PWM2: JP4.3
PWM3: JP4.4
PWM5: JP4.6
PWM6: JP4.7
PWM7: JP4.8
PWM8: JP3.1
PWM11: JP3.4
PWM12: JP3.5
PWM13: JP3.6
RX: JP4.1
RXD0: JP5.2
RXD1: JP5.4
RXD2: JP5.6
SCL0-3: JP5.8
SCL1: JP3.10 ; also sheet 1
SDA0-3: JP5.7
SDA1: JP3.9 ; also sheet 1
SS1/PWM4: JP4.5
TX: JP4.2
TXD0: JP5.1
TXD1: JP5.3
TXD2: JP5.5
VIN: JP6.8 ; also sheet 4
VIN_5V: D5.1(K) ; also sheet 4
Unconnected: JP6.1 JP6.2 JP6.4 JP7.2 JP7.3

### Notes on the sheet
- Arduino Shield Headers
- 14 | Test LEDs and Testpoints
- 15
- 16
- 17
- 18
- 19
- TWD1 | 20
- TWCK1 | 21
- AD0
- URXD | 0 | AD1
- UTXD | 1 | AD2
- 2 | AD3
- 3 | AD4
- SD-CS | 4 | AD5
- TWI pullups | 5 | AD6
- 6 | AD7
- 7
- 8
- 9
- ETH-CS | 10
- 11
- 12 | IOREF
- 13
- AREF
- TWD0
- TWCK0
- Emergency OFF switch
- Headers & Connectors
- Neuralaxy LLC | 1.1

## Sheet 6 of 6
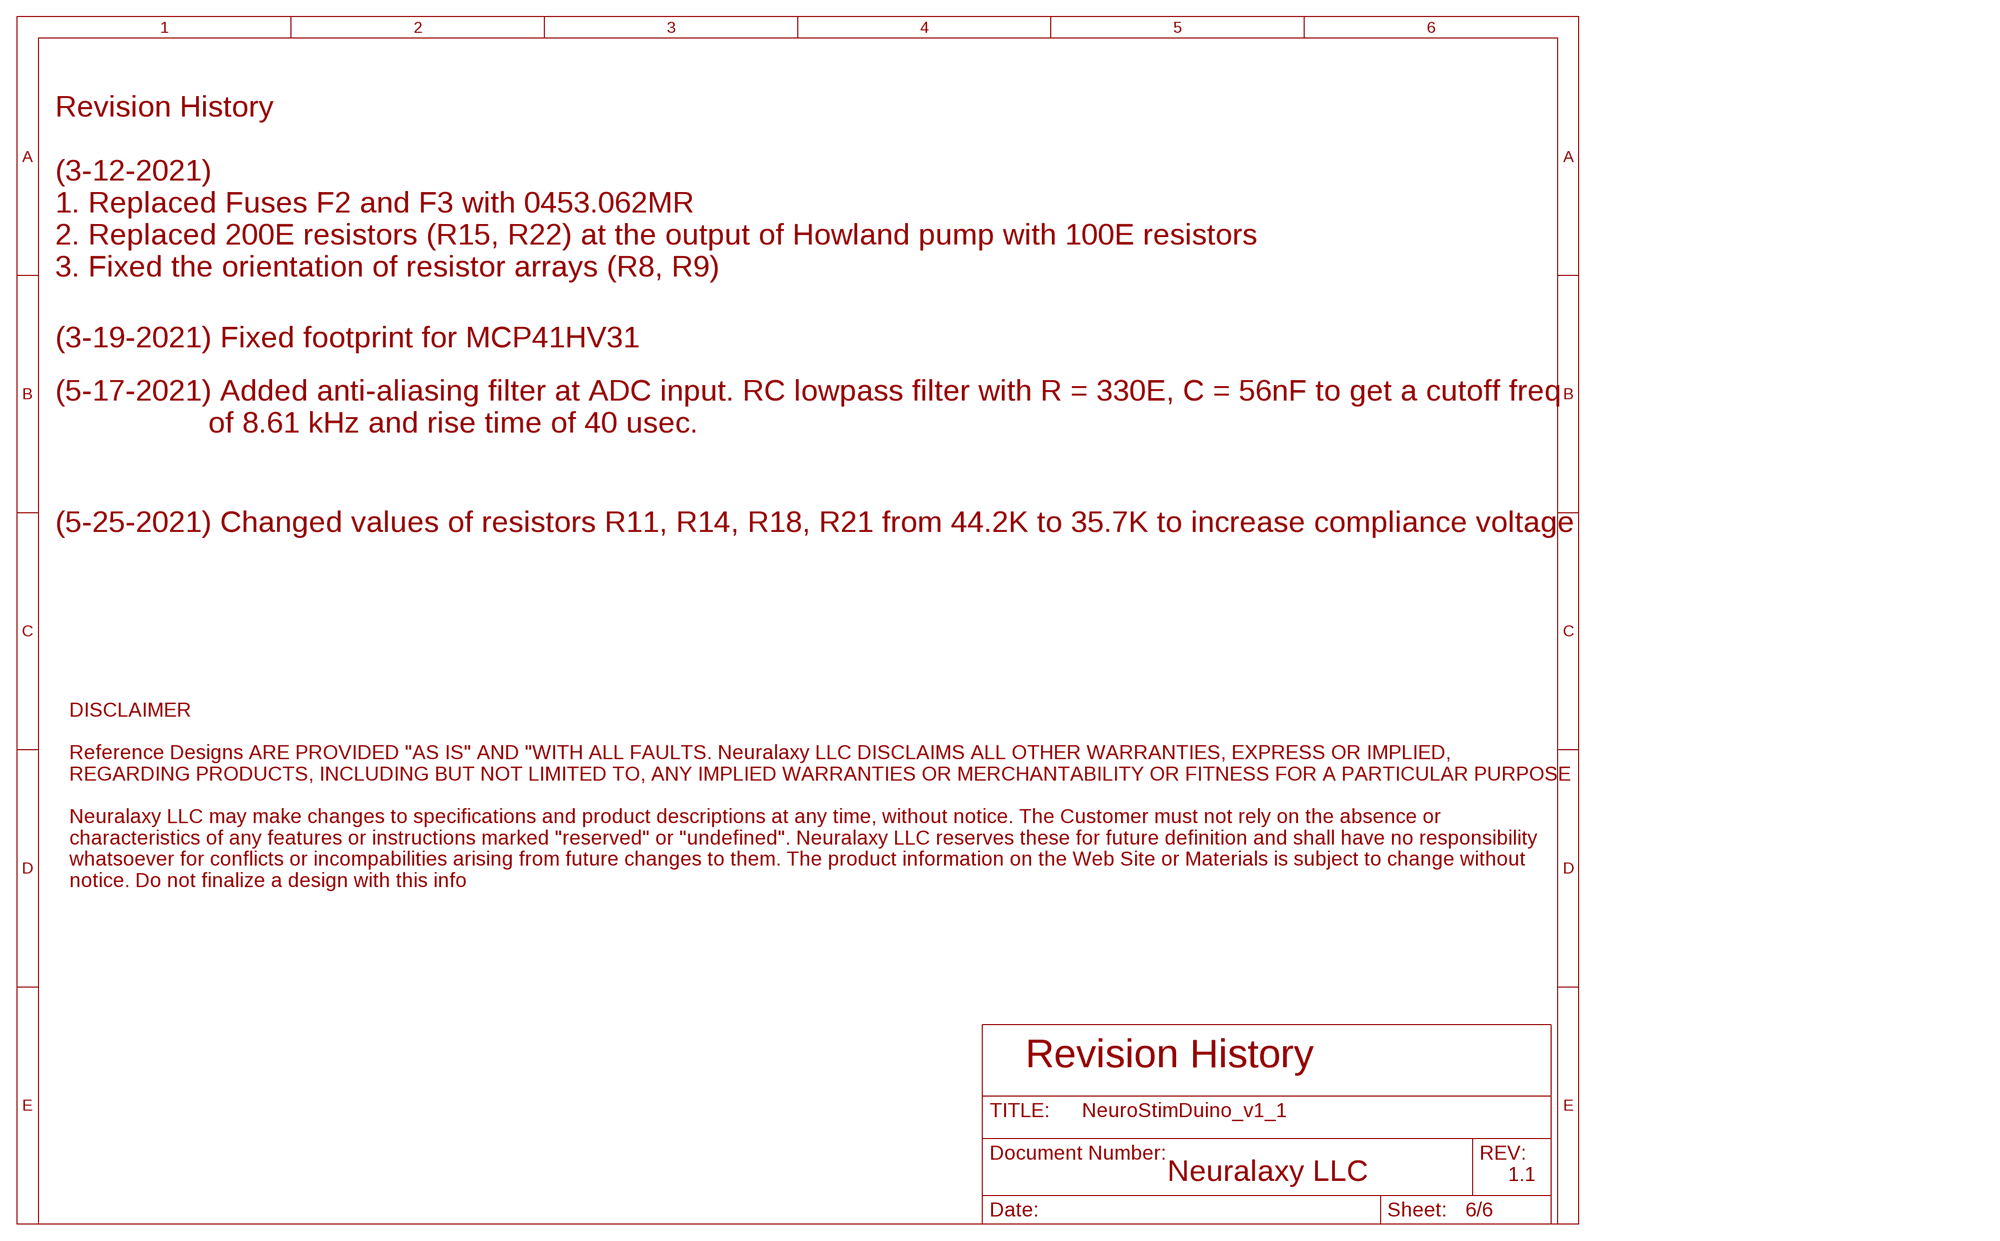
[diagram p5: schematic, sheet 6]

### Notes on the sheet
- Revision History
  
  (3-12-2021)
  1. Replaced Fuses F2 and F3 with 0453.062MR
  2. Replaced 200E resistors (R15, R22) at the output of Howland pump with 100E resistors
  3. Fixed the orientation of resistor arrays (R8, R9)
- (3-19-2021) Fixed footprint for MCP41HV31
- (5-17-2021) Added anti-aliasing filter at ADC input. RC lowpass filter with R = 330E, C = 56nF to get a cutoff freq 
                    of 8.61 kHz and rise time of 40 usec.
- (5-25-2021) Changed values of resistors R11, R14, R18, R21 from 44.2K to 35.7K to increase compliance voltage
- DISCLAIMER
  
  Reference Designs ARE PROVIDED "AS IS" AND "WITH ALL FAULTS. Neuralaxy LLC DISCLAIMS ALL OTHER WARRANTIES, EXPRESS OR IMPLIED, 
  REGARDING PRODUCTS, INCLUDING BUT NOT LIMITED TO, ANY IMPLIED WARRANTIES OR MERCHANTABILITY OR FITNESS FOR A PARTICULAR PURPOSE
  
  Neuralaxy LLC may make changes to specifications and product descriptions at any time, without notice. The Customer must not rely on the absence or 
  characteristics of any features or instructions marked "reserved" or "undefined". Neuralaxy LLC reserves these for future definition and shall have no responsibility 
  whatsoever for conflicts or incompabilities arising from future changes to them. The product information on the Web Site or Materials is subject to change without 
  notice. Do not finalize a design with this info
- Revision History
- Neuralaxy LLC | 1.1

## Library data of the parts
1.6V 3.3V +5V +HV -5V -HV AGND CS1 CS2 DGND OC1-OC4 SCK SDI SDO V1-V4 VF/B1 VF/B2 VIN5V VO1 VO2 VSTIM1 VSTIM2 = testpad:TP: Test pad
C1 C3-C5 C25 C28 = rcl:C-US: CAPACITOR, American symbol
C2 C9 C10 C17 C18 = SamacSys_Parts:F971C475MAAHT3: Tantalum Capacitors - Solid SMD 16V 4.7uF 20% 1206 ESR=4Ohm AEC-Q200 Source: Datasheet <http://datasheets.avx.com/AVX-F97-HT3.pdf>; DESCRIPTION: Tantalum Capacitors - Solid SMD 16V 4.7uF 20% 1206 ESR=4Ohm AEC-Q200; HEIGHT: 1.8mm; MANUFACTURER_NAME: AVX; MANUFACTURER_PART_NUMBER: F971C475MAAHT3; MOUSER_PART_NUMBER: 581-F971C475MAAHT3; MOUSER_PRICE-STOCK: https://www.mouser.co.uk/ProductDetail/AVX/F971C475MAAHT3?qs=fAHHVMwC%252BbhF6LG88tZoVw%3D%3D
C6-C8 C13 C14 C19 C21 C26 C27 C31 C32 C35-C40 = rcl:C-US: CAPACITOR, American symbol; SPICEPREFIX: C
C11 = Capacitor_56nF:C0603C563J4RACTU; BUILT_BY: EMA_Frank; MANUFACTURER_PART_NUMBER: C0603C563J4RACTU; SOURCELIBRARY: Kemet_2020-03-25_2a; SOURCE_LIBRARY: Kemet_2020-03-25_2.xlr; VENDOR: Kemet
C29 = Condensatori:0113_47UF: 47uF; MONTHLY_USAGE: _____; PART_NUMBER: 47uF; PRICE: _____; SUPPLIER: _____; TYPE: Condensatori
C30 C33 C34 = SamacSys_Parts:593D475X9050D2TE3: Solid Tantalum Surface Mount Chip Capacitors TANTAMOUNT(TM), Molded Case, Low ESR Source: Datasheet <http://www.vishay.com/doc?40005>; DESCRIPTION: Solid Tantalum Surface Mount Chip Capacitors TANTAMOUNT(TM), Molded Case, Low ESR; HEIGHT: 3.1mm; MANUFACTURER_NAME: Vishay; MANUFACTURER_PART_NUMBER: 593D475X9050D2TE3; MOUSER_PART_NUMBER: 74-593D475X9050D2TE3; MOUSER_PRICE-STOCK: https://www.mouser.co.uk/ProductDetail/Vishay-Sprague/593D475X9050D2TE3?qs=%2F2iC%2FhUAFZ8P2kDjostoFw%3D%3D
D2 = Diodi:0025_SS1P3L-M3/84A: 1A 30V Schottky Barrier Rectifiers -SS1P3L-M3/84A; CASE: SMP; MONTHLY_USAGE: _____; PART_NUMBER: SS1P3L-M3/84A; PRICE: _____; SUPPLIER: _____; TYPE: Diodi
D3 = Diodi:1653_MSS1P3L-M3/89A: Surface Mount Schottky Barrier Rectifiers - Case microSMP
D4 D5 = SamacSys_Parts:LSM115JE3_TR13: Schottky Diodes & Rectifiers Schottky Source: Datasheet <https://media.digikey.com/pdf/Data Sheets/Microsemi PDFs/LSM115J.pdf>; ARROW_PART_NUMBER: LSM115JE3/TR13; ARROW_PRICE-STOCK: https://www.arrow.com/en/products/lsm115je3tr13/microsemi; DESCRIPTION: Schottky Diodes & Rectifiers Schottky; HEIGHT: 3.3mm; MANUFACTURER_NAME: Microsemi Corporation; MANUFACTURER_PART_NUMBER: LSM115JE3/TR13; MOUSER_PART_NUMBER: 494-LSM115JE3/TR13; MOUSER_PRICE-STOCK: https://www.mouser.co.uk/ProductDetail/Microchip-Microsemi/LSM115JE3-TR13?qs=6jAvgNDGUA8H9k1qUsKdHA%3D%3D
D6-D9 = ServoStim_components:GF1J-E3; BUILT_BY: EMA_UL_Team; MANUFACTURER_PART_NUMBER: GF1J-E3; VENDOR: Vishay
F1 = Protezione:0002_MF-MSMF050-2: 500 mA Multifuse � Polyfuse; MONTHLY_USAGE: _____; PART_NUMBER: MF-MSMF050-2; PRICE: _____; SUPPLIER: _____; TYPE: Protezione
F2 F3 = SamacSys_Parts:0453.062MR: Surface Mount Fuses 125VAC 0.062A 5.5ohms 453 NANO2 Source: Datasheet <https://m.littelfuse.com/~/media/electronics/datasheets/fuses/littelfuse_fuse_451_453_datasheet.pdf.pdf>; DESCRIPTION: Surface Mount Fuses 125VAC 0.062A 5.5ohms 453 NANO2; HEIGHT: 2.94mm; MANUFACTURER_NAME: LITTELFUSE; MANUFACTURER_PART_NUMBER: 0453.062MR
IC1 = SamacSys_Parts:DSPIC33FJ256GP506A-I_PT: MCU&DSP 256K Flash 16K RAM DMA TQFP64 Source: Datasheet <https://componentsearchengine.com/Datasheets/1/dsPIC33FJ256GP506A-I_PT.pdf>; DESCRIPTION: MCU&DSP 256K Flash 16K RAM DMA TQFP64; HEIGHT: 1.2mm; MANUFACTURER_NAME: Microchip; MANUFACTURER_PART_NUMBER: dsPIC33FJ256GP506A-I/PT; MOUSER_PART_NUMBER: 579-FJ256GP506A-I/PT; MOUSER_PRICE-STOCK: https://www.mouser.com/Search/Refine.aspx?Keyword=579-FJ256GP506A-I%2FPT
IC2 = ftdichip:FT232R: Source: http://www.ftdichip.com/Documents/DataSheets/DS_FT232R_v104.pdf; MPN: FT232RL; OC_FARNELL: 1146032; OC_NEWARK: 91K9918
IC3 IC4 = SamacSys_Parts:HCPL0531: Optocoupler 2-Ch Transistor 1MBit/s SO8 Source: Datasheet <https://componentsearchengine.com/Datasheets/1/HCPL0531.pdf>; DESCRIPTION: Optocoupler 2-Ch Transistor 1MBit/s SO8; HEIGHT: 3.63mm; MANUFACTURER_NAME: ON Semiconductor; MANUFACTURER_PART_NUMBER: HCPL0531; MOUSER_PART_NUMBER: 512-HCPL0531; MOUSER_PRICE-STOCK: https://www.mouser.com/Search/Refine.aspx?Keyword=512-HCPL0531
IC5 IC8 = SamacSys_Parts:INA149AID: Texas Instruments INA149AID, Differential Amplifier 8-Pin SOIC Source: Datasheet <http://www.ti.com/lit/ds/symlink/ina149.pdf>; DESCRIPTION: Texas Instruments INA149AID, Differential Amplifier 8-Pin SOIC; HEIGHT: 1.75mm; MANUFACTURER_NAME: Texas Instruments; MANUFACTURER_PART_NUMBER: INA149AID; MOUSER_PART_NUMBER: 595-INA149AID; MOUSER_PRICE-STOCK: https://www.mouser.co.uk/ProductDetail/Texas-Instruments/INA149AID?qs=Wh9GCymT6P2PNMu%252BdLSSCA%3D%3D
IC6 = SamacSys_Parts:TSC2012IST: SP Amp Current Sense Amp Single 5.5V 8-Pin Mini-SO T/R Source: Datasheet <https://componentsearchengine.com/Datasheets/1/TSC2011IST.pdf>; DESCRIPTION: SP Amp Current Sense Amp Single 5.5V 8-Pin Mini-SO T/R; HEIGHT: 1.1mm; MANUFACTURER_NAME: STMicroelectronics; MANUFACTURER_PART_NUMBER: TSC2011IST; MOUSER_PART_NUMBER: 511-TSC2011IST; MOUSER_PRICE-STOCK: https://www.mouser.com/Search/Refine.aspx?Keyword=511-TSC2011IST
IC7 IC10 = SamacSys_Parts:OPA140AID: 11MHz, Single Supply, Low Noise, Precision, Rail-to-Rail Output, JFET Amplifier Source: Datasheet <http://www.ti.com/lit/ds/symlink/opa140.pdf>; DESCRIPTION: 11MHz, Single Supply, Low Noise, Precision, Rail-to-Rail Output, JFET Amplifier; HEIGHT: 1.75mm; MANUFACTURER_NAME: Texas Instruments; MANUFACTURER_PART_NUMBER: OPA140AID; MOUSER_PART_NUMBER: 595-OPA140AID; MOUSER_PRICE-STOCK: https://www.mouser.co.uk/ProductDetail/Texas-Instruments/OPA140AID?qs=nHis3Socmoot4ds0ZYmjJQ%3D%3D
IC13 = SamacSys_Parts:TPS73633DBVR: Single Output LDO, 400mA, Adj.(1.2 to 5.5V), Cap free, Low Noise, Reverse Current Protection Source: Datasheet <http://www.ti.com/lit/gpn/tps736>; DESCRIPTION: Single Output LDO, 400mA, Adj.(1.2 to 5.5V), Cap free, Low Noise, Reverse Current Protection; HEIGHT: 1.45mm; MANUFACTURER_NAME: Texas Instruments; MANUFACTURER_PART_NUMBER: TPS73633DBVR; MOUSER_PART_NUMBER: 595-TPS73633DBVR; MOUSER_PRICE-STOCK: https://www.mouser.co.uk/ProductDetail/Texas-Instruments/TPS73633DBVR?qs=6zVL%252ByCp0mrGq%2FL4KaY0Yw%3D%3D
IC14 = SamacSys_Parts:MIC3975-5.0YMM-TR: ic Source: Datasheet <http://www.microchip.com/mymicrochip/filehandler.aspx?ddocname=en579097>; DESCRIPTION: ic; HEIGHT: 1.09mm; MANUFACTURER_NAME: Microchip; MANUFACTURER_PART_NUMBER: MIC3975-5.0YMM-TR
J1 = con-molex:22-?-05: CONNECTOR wire to board 2.54 mm (.1 inch) pitch header; MF: MOLEX; OC_FARNELL: unknown; OC_NEWARK: unknown
J2 = SamacSys_Parts:47346-0001: Micro USB B Receptacle Bottom Mount Assy Molex Right Angle SMT Type B Version 2.0 Micro USB Connector Socket, 30 V ac, 1A 47352 MICRO-USB Source: Datasheet <http://www.molex.com/pdm_docs/sd/473460001_sd.pdf>; DESCRIPTION: Micro USB B Receptacle Bottom Mount Assy Molex Right Angle SMT Type B Version 2.0 Micro USB Connector Socket, 30 V ac, 1A 47352 MICRO-USB; HEIGHT: mm; MANUFACTURER_NAME: Molex; MANUFACTURER_PART_NUMBER: 47346-0001; MOUSER_PART_NUMBER: 538-47346-0001; MOUSER_PRICE-STOCK: https://www.mouser.co.uk/ProductDetail/Molex/47346-0001?qs=c2CV6XM0DweJBWaSeyWeCw%3D%3D
J3 J4 = DC_power_jack2_35mm:694101308002: WR-DC DC Power Jack THT Right Angled Low Profile (2.8) KIND PROPERTIES Quality Class 5 000 Mating cycles Type Right Angled MATERIAL PROPERTIES Insulator Material PA66 Insulator Flammability Rating UL94 V-0 Color Black Contact Material Copper Alloy Contact Type Stamped Center Pin Plating Gold Tip Spring Material Tin Shunt Terminal Plating Tin GENERAL INFORMATION Operating Temperature -40 up to +85 °C Compliance RoHS ELECTRICAL PROPERTIES IR 1 2 A Working Voltage 12 V (AC) Withstanding Voltage 500 V (AC) Contact Resistance 30 mΩ RISO 100 MΩ PACKAGING PROPERTIES Packaging Bag <https://katalog.we-online.com/media/images/v2/o60624v209%20Family_WR-DC_THT_694101308002_pf2.jpg> Details see: https://katalog.we-online.com/en/em/DC_THT_RIGHT_ANGLED_LOW_PROFILE_2_8_694101308002 Updated by Ella Wu 2019-11-01 2019(C) Wurth Elektronik; DATASHEET-URL: https://katalog.we-online.com/em/datasheet/694101308002.pdf; IR: 2A; MOUNT: THT; PART-NUMBER: 694101308002; TYPE: Right Angled; WORKING-VOLTAGE: 12V(AC)
J5 J6 = SamacSys_Parts:TMS-103-02-L-S: 3 Position, Single-Row .050" x .100" Micro Terminal Strip Source: Datasheet <https://componentsearchengine.com/Datasheets/1/TMS-103-02-L-S.pdf>; DESCRIPTION: 3 Position, Single-Row .050&quot; x .100&quot; Micro Terminal Strip; HEIGHT: mm; MANUFACTURER_NAME: SAMTEC; MANUFACTURER_PART_NUMBER: TMS-103-02-L-S; MOUSER_PART_NUMBER: 200-TMS10302LS; MOUSER_PRICE-STOCK: https://www.mouser.com/Search/Refine.aspx?Keyword=200-TMS10302LS
J7 = SamacSys_Parts:CON-SOCJ-2155: DC Power Connectors Power Jack/Connector 2.1mm x 5.5mm Source: Datasheet <http://www.produktinfo.conrad.com/datenblaetter/1500000-1599999/001582350-da-01-en-DC_EINBAUBUCHSE__SCHALTER_GESCHLOSSEN.pdf>; DESCRIPTION: DC Power Connectors Power Jack/Connector 2.1mm x 5.5mm; HEIGHT: 11mm; MANUFACTURER_NAME: Gravitech; MANUFACTURER_PART_NUMBER: CON-SOCJ-2155; MOUSER_PART_NUMBER: 992-CON-SOCJ-2155; MOUSER_PRICE-STOCK: https://www.mouser.co.uk/ProductDetail/Gravitech/CON-SOCJ-2155?qs=fkzBJ5HM%252BdCcpvFQyQZHtA%3D%3D
JP3 = Connettori:1684_20TW-537: Female Gray Connector strip for Arduino 3V3 bases - 10x1 F V h 8,5 p2,54mm; MONTHLY_USAGE: _____; PART_NUMBER: 20TW-537; PRICE: _____; SUPPLIER: _____; TYPE: Connettori
JP4-JP8 = Connettori:1683_20TW-536: Female Gray Connector strip for Arduino 3V3 bases - 8x1 F V h 8,5 p2,54mm; MONTHLY_USAGE: _____; PART_NUMBER: 20TW-536; PRICE: _____; SUPPLIER: _____; TYPE: Connettori
K1 = SamacSys_Parts:LBB110P: Solid State Relays - PCB Mount 350V 120mA Dual Sing OptoMOS Relay Source: Datasheet <http://www.ixysic.com/home/pdfs.nsf/www/LBB110.pdf/$file/LBB110.pdf>; DESCRIPTION: Solid State Relays - PCB Mount 350V 120mA Dual Sing OptoMOS Relay; HEIGHT: 2.286mm; MANUFACTURER_NAME: IXYS SEMICONDUCTOR; MANUFACTURER_PART_NUMBER: LBB110P; MOUSER_PART_NUMBER: 849-LBB110P; MOUSER_PRICE-STOCK: https://www.mouser.co.uk/ProductDetail/IXYS-Integrated-Circuits/LBB110P?qs=h2iAtNzNjMSczZ2gNIY8JA%3D%3D
L1 = Protezione:0001_BLM21PG300SN1D_/_MH2029-300Y: BLM21; MONTHLY_USAGE: _____; PART_NUMBER: BLM21PG300SN1D_/_MH2029-300Y; PRICE: _____; SUPPLIER: _____; TYPE: Protezione
LED1 LED2 LED5 LED6 = led:LED: LED OSRAM: - CHIPLED LG R971, LG N971, LY N971, LG Q971, LY Q971, LO R971, LY R971 LH N974, LH R974 LS Q976, LO Q976, LY Q976 LO Q996 - Hyper CHIPLED LW Q18S LB Q993, LB Q99A, LB R99A - SideLED LS A670, LO A670, LY A670, LG A670, LP A670 LB A673, LV A673, LT A673, LW A673 LH A674 LY A675 LS A676, LA A676, LO A676, LY A676, LW A676 LS A679, LY A679, LG A679 - Hyper Micro SIDELED® LS Y876, LA Y876, LO Y876, LY Y876 LT Y87S - SmartLED LW L88C, LW L88S LB L89C, LB L89S, LG L890 LS L89K, LO L89K, LY L89K LS L896, LA L896, LO L896, LY L896 - TOPLED LS T670, LO T670, LY T670, LG T670, LP T670 LSG T670, LSP T670, LSY T670, LOP T670, LYG T670 LG T671, LOG T671, LSG T671 LB T673, LV T673, LT T673, LW T673 LH T674 LS T676, LA T676, LO T676, LY T676, LB T676, LH T676, LSB T676, LW T676 LB T67C, LV T67C, LT T67C, LS T67K, LO T67K, LY T67K, LW E67C LS E67B, LA E67B, LO E67B, LY E67B, LB E67C, LV E67C, LT E67C LW T67C LS T679, LY T679, LG T679 LS T770, LO T770, LY T770, LG T770, LP T770 LB T773, LV T773, LT T773, LW T773 LH T774 LS E675, LA E675, LY E675, LS T675 LS T776, LA T776, LO T776, LY T776, LB T776 LHGB T686 LT T68C, LB T68C - Hyper Mini TOPLED® LB M676 - Mini TOPLED Santana® LG M470 LS M47K, LO M47K, LY M47K Source: http://www.osram.convergy.de LUXEON: - LUMILED® LXK2-PW12-R00, LXK2-PW12-S00, LXK2-PW14-U00, LXK2-PW14-V00 LXK2-PM12-R00, LXK2-PM12-S00, LXK2-PM14-U00 LXK2-PE12-Q00, LXK2-PE12-R00, LXK2-PE12-S00, LXK2-PE14-T00, LXK2-PE14-U00 LXK2-PB12-K00, LXK2-PB12-L00, LXK2-PB12-M00, LXK2-PB14-N00, LXK2-PB14-P00, LXK2-PB14-Q00 LXK2-PR12-L00, LXK2-PR12-M00, LXK2-PR14-Q00, LXK2-PR14-R00 LXK2-PD12-Q00, LXK2-PD12-R00, LXK2-PD12-S00 LXK2-PH12-R00, LXK2-PH12-S00 LXK2-PL12-P00, LXK2-PL12-Q00, LXK2-PL12-R00 Source: www.luxeon.com KINGBRIGHT: KA-3528ASYC Source: www.kingbright.com
LED3 LED4 = ServoStim_components:XZMDKVG55W-4; BUILT_BY: EMA_Matt; COPYRIGHT: Copyright (C) 2018 Accelerated Designs. All rights reserved; DATASHEET: https://www.sunledusa.com/products/spec/XZMDKVG55W-4.pdf; MANUFACTURER_PART_NUMBER: XZMDKVG55W-4; SOURCELIBRARY: SunLED_2020-06-23; VENDOR: SunLED
PS1 PS2 = SamacSys_Parts:NMT0572SC: Murata Power Solutions NMT 3W Isolated DC-DC Converter Through Hole, Vin 4.5 5.5 V dc, Vout -72/-48/-24V dc Source: Datasheet <https://componentsearchengine.com/Datasheets/1/NMT0572SC.pdf>; DESCRIPTION: Murata Power Solutions NMT 3W Isolated DC-DC Converter Through Hole, Vin 4.5 5.5 V dc, Vout -72/-48/-24V dc; HEIGHT: mm; MANUFACTURER_NAME: Murata Electronics; MANUFACTURER_PART_NUMBER: NMT0572SC; MOUSER_PART_NUMBER: 580-NMT0572SC; MOUSER_PRICE-STOCK: https://www.mouser.com/Search/Refine.aspx?Keyword=580-NMT0572SC
Q1 Q3 = SamacSys_Parts:MJE350: Source: Datasheet <http://www.onsemi.com/pub/Collateral/MJE350-D.PDF>; HEIGHT: 3mm; MANUFACTURER_NAME: ON Semiconductor; MANUFACTURER_PART_NUMBER: MJE350G; MOUSER_PART_NUMBER: 863-MJE350G; MOUSER_PRICE-STOCK: https://www.mouser.co.uk/ProductDetail/ON-Semiconductor/MJE350G?qs=HVbQlW5zcXWTTP4DzSDnGQ%3D%3D
Q2 Q4 = SamacSys_Parts:MJE340: MJE340, NPN Bipolar Transistor, 0.5 A 300 V HFE:30 V Power, 3-Pin SOT-32 Source: Datasheet <http://www.st.com/content/ccc/resource/technical/document/datasheet/5b/dc/08/b4/0b/64/4a/f0/CD00000930.pdf/files/CD00000930.pdf/jcr:content/translations/en.CD00000930.pdf>; DESCRIPTION: MJE340, NPN Bipolar Transistor, 0.5 A 300 V HFE:30 V Power, 3-Pin SOT-32; HEIGHT: 2.9mm; MANUFACTURER_NAME: STMicroelectronics; MANUFACTURER_PART_NUMBER: MJE340; MOUSER_PART_NUMBER: 511-MJE340; MOUSER_PRICE-STOCK: https://www.mouser.co.uk/ProductDetail/STMicroelectronics/MJE340?qs=ljbEvF4DwOOM%2F0OivYFcGg%3D%3D
Q8 = SamacSys_Parts:MMBT3906: Transistor GP BJT PNP 40V 0.2A SOT23 Fairchild MMBT3906 PNP Bipolar Transistor, 0.2 A, 40 V, 3-Pin SOT-23 Source: Datasheet <http://akizukidenshi.com/download/ds/fairchild/2N3904_MMBT3904_PZT3904.pdf>; DESCRIPTION: Transistor GP BJT PNP 40V 0.2A SOT23 Fairchild MMBT3906 PNP Bipolar Transistor, 0.2 A, 40 V, 3-Pin SOT-23; HEIGHT: 1.2mm; MANUFACTURER_NAME: ON Semiconductor; MANUFACTURER_PART_NUMBER: MMBT3906; MOUSER_PART_NUMBER: 512-MMBT3906; MOUSER_PRICE-STOCK: https://www.mouser.co.uk/ProductDetail/ON-Semiconductor-Fairchild/MMBT3906?qs=UMEuL5FsraBPiZDsobnR3A%3D%3D
R1-R7 R26-R28 R36 R37 = rcl:R-US_: RESISTOR, American symbol
R8 = ServoStim_components:4605X-101-221LF; BUILT_BY: EMA_UL_Team; MANUFACTURER_PART_NUMBER: 4605X-101-222LF; SOURCELIBRARY: Bourns_2014-12-31; VENDOR: Bourns Electronics
R9 = ServoStim_components:4605X-101-332LF; BUILT_BY: EMA_UL_Team; MANUFACTURER_PART_NUMBER: 4605X-101-222LF; SOURCELIBRARY: Bourns_2014-12-31; VENDOR: Bourns Electronics
R10-R25 R32-R34 = rcl:R-US_: RESISTOR, American symbol; SPICEPREFIX: R
S1 = SparkFun:SWITCH-MOMENTARY-2
S2 = SamacSys_Parts:3006.2115: Tactile Switches TACTILE Source: Datasheet <https://www.mouser.co.uk/datasheet/2/467/Marquardt_007102018_Specifcation3006_Series-1379934.pdf>; DESCRIPTION: Tactile Switches TACTILE; HEIGHT: 4.15mm; MANUFACTURER_NAME: Marquardt Switches; MANUFACTURER_PART_NUMBER: 3006.2115; MOUSER_PART_NUMBER: 979-3006.2115; MOUSER_PRICE-STOCK: https://www.mouser.co.uk/ProductDetail/Marquardt-Switches/30062115?qs=zlv9Rr0w%252BHrgM7xLaRCeRw%3D%3D
S3 = SamacSys_Parts:1101M2S3CQE2: 1101M2S3CQE2 (Slide Switches) Source: Datasheet <https://www.ckswitches.com/media/1429/1000.pdf>; DESCRIPTION: 1101M2S3CQE2 (Slide Switches); HEIGHT: mm; MANUFACTURER_NAME: C & K COMPONENTS; MANUFACTURER_PART_NUMBER: 1101M2S3CQE2; MOUSER_PART_NUMBER: 611-1101M2S3CQE2; MOUSER_PRICE-STOCK: https://www.mouser.co.uk/ProductDetail/CK/1101M2S3CQE2?qs=C4UUOezh8MStnZqkTHGAfQ%3D%3D
TP1-TP4 = Arduino-utility:TP: Testpoint; DATASHEET: DNP; DISTRIBUTOR-LINK: DNP; DISTRIBUTOR-PN: DNP; MANUFACTURER: DNP; MANUFACTURER-PN: DNP
U1 = ServoStim_components:AD826ARZ; BUILT_BY: EMA_UL_Team; MANUFACTURER_PART_NUMBER: AD826ARZ; SOURCELIBRARY: Analog_2012-01-01_5; VENDOR: Analog Devices Inc
U2 U3 = ServoStim_components:LT1991IMSPBF; BUILT_BY: EMA_UL_Team; MANUFACTURER_PART_NUMBER: LT1991IMS#PBF; SOURCELIBRARY: LinearTech_2016-05-13_6; VENDOR: Linear Technology
U4 U5 = ServoStim_components:MCP41HV31-103E/ST; BUILT_BY: EMA_Jessica; COPYRIGHT: Copyright (C) 2018 Accelerated Designs. All rights reserved; MANUFACTURER_PART_NUMBER: MCP41HV31-103E/ST; SOURCELIBRARY: Update_to_database_2021-03-19; VENDOR: Microchip
U6 = ServoStim_components:LTC4412HS6TRMPBF; BUILT_BY: EMA_Cory; COPYRIGHT: Copyright (C) 2018 Accelerated Designs. All rights reserved; DATASHEET: https://www.analog.com/media/en/technical-documentation/data-sheets/4412fb.pdf; MANUFACTURER_PART_NUMBER: LTC4412HS6#TRMPBF; SOURCELIBRARY: Analog_Devices__2020-06-04; VENDOR: Analog Devices Inc
U7 = ServoStim_components:PMV48XP,215; BUILT_BY: EMA_Cory; COPYRIGHT: Copyright (C) 2018 Accelerated Designs. All rights reserved; MANUFACTURER_PART_NUMBER: PMV48XP,215; SOURCELIBRARY: Nexperia_2019-12-03; VENDOR: Nexperia
U8 = PDME1-S5-D5-S:PDME1-S5-D5-S: 1 W, 1:1 Input Range, Single/Dual Unregulated Output, SIP, 1500 Vdc Isolation, Dc-Dc Converter; AVAILABILITY: Unavailable; CUI_PURCHASE_URL: https://www.cui.com/product/dc-dc-converters/isolated/pdme1-s-series?utm_source=snapeda.com&utm_medium=referral&utm_campaign=snapedaBOM; DESCRIPTION: 1 W, 1:1 Input Range, Single/Dual Unregulated Output, SIP, 1500 Vdc Isolation, Dc-Dc Converter; DIGIKEY-PURCHASE-URL: https://snapeda.com/shop?store=DigiKey&id=3623307; MF: CUI; MP: PDME1-S5-D5-S; PACKAGE: SIP-7 CUI; PRICE: None
U9 = ServoStim_components:MAX6018BEUR16+T; BUILT_BY: EMA_UL_Team; MANUFACTURER_PART_NUMBER: MAX6018BEUR16+T; SOURCELIBRARY: Maxim_2014-06-20; VENDOR: Maxim Integrated Products
U$1-U$3 = SmartPrj:FIDUCIALMOUNT

## Net classes
0 digital: width 0.203 mm, clearance 0.203 mm
1 Power: width 0.254 mm, clearance 0.203 mm
2 Signal: width 0.61 mm, clearance 0.305 mm
3 usbvcc: width 0.203 mm, drill 0.406 mm, clearance 0.203 mm
4 USBpair: width 0.254 mm, drill 0.406 mm, clearance 0.61 mm to class 0, clearance 0.61 mm to class 1, clearance 0.61 mm to class 2, clearance 0.61 mm to class 3